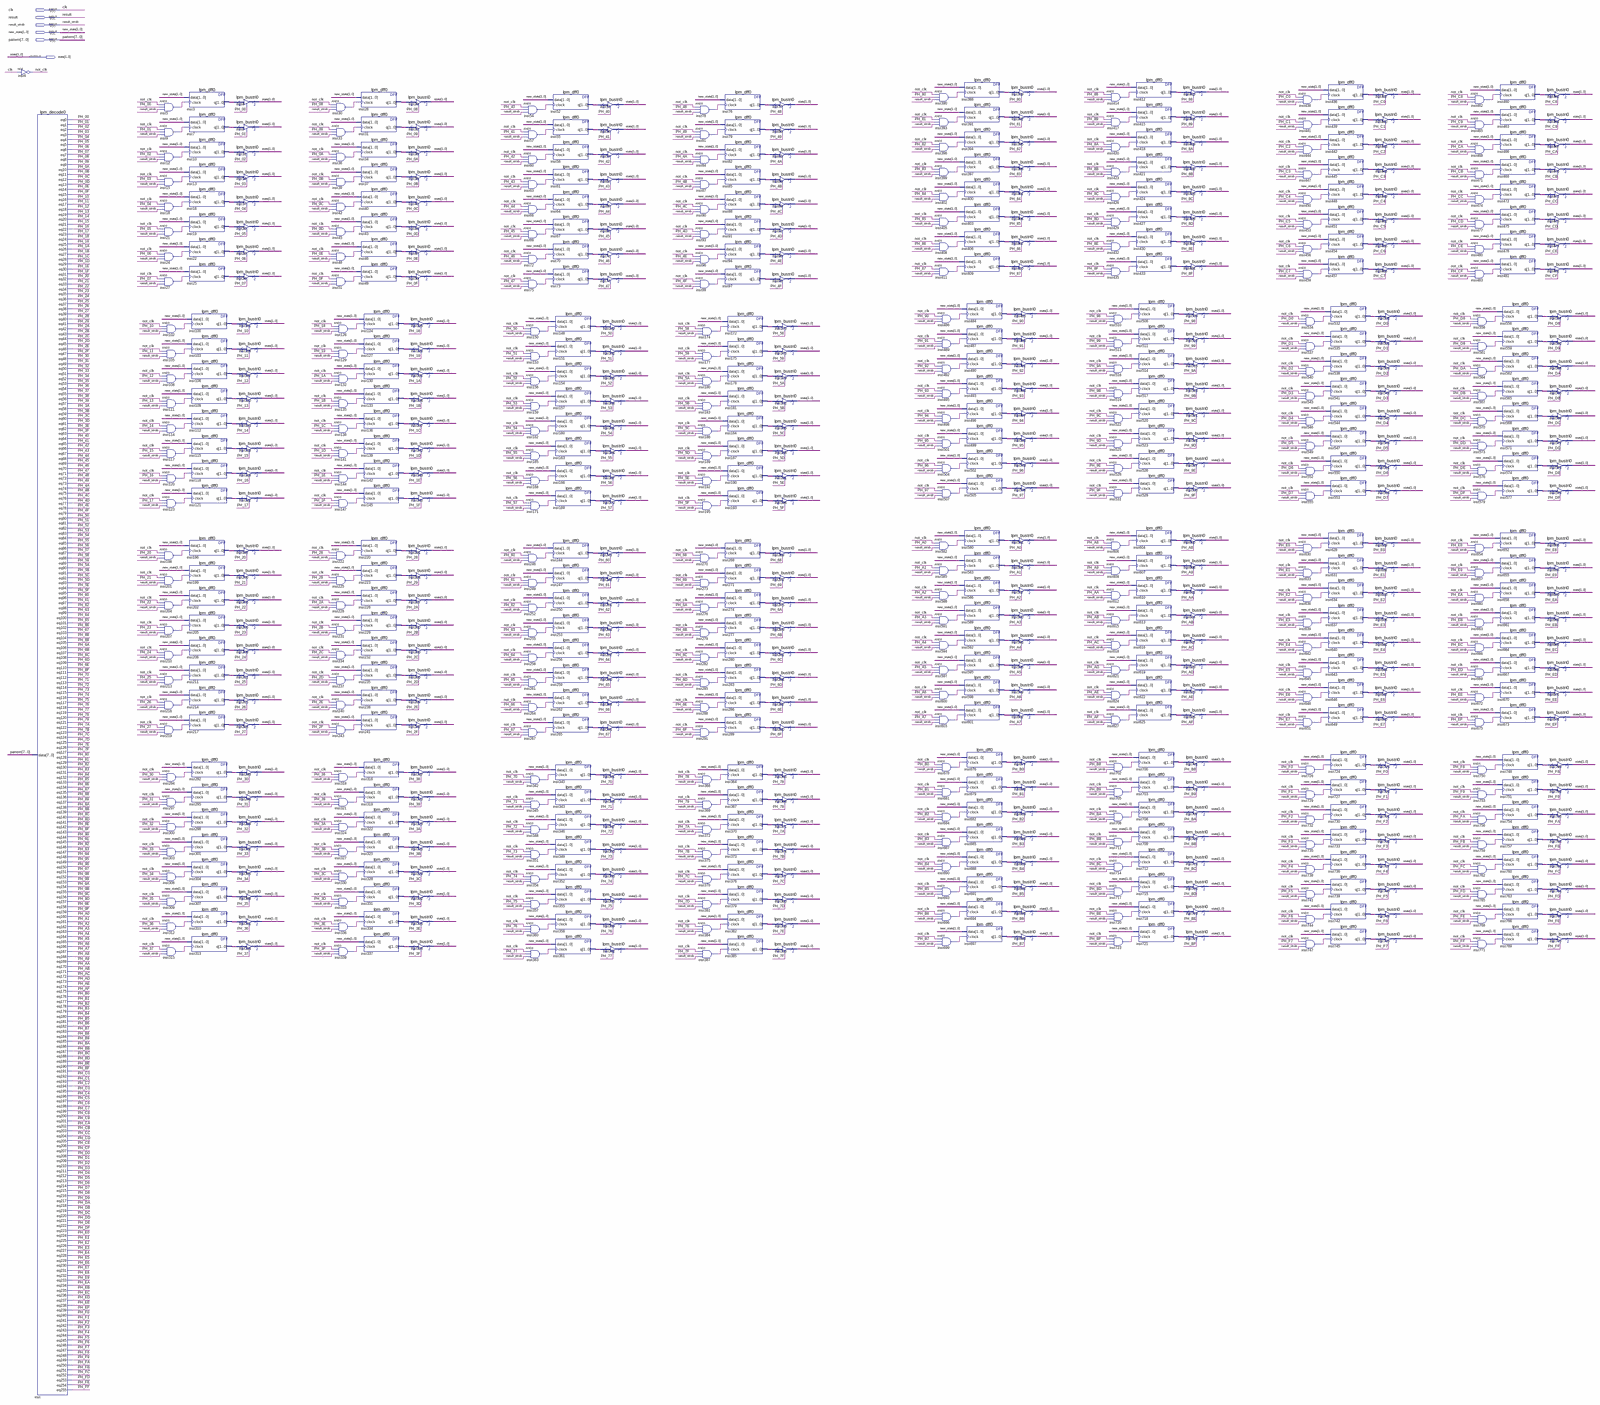
[diagram p0: schematic sheet, whole]
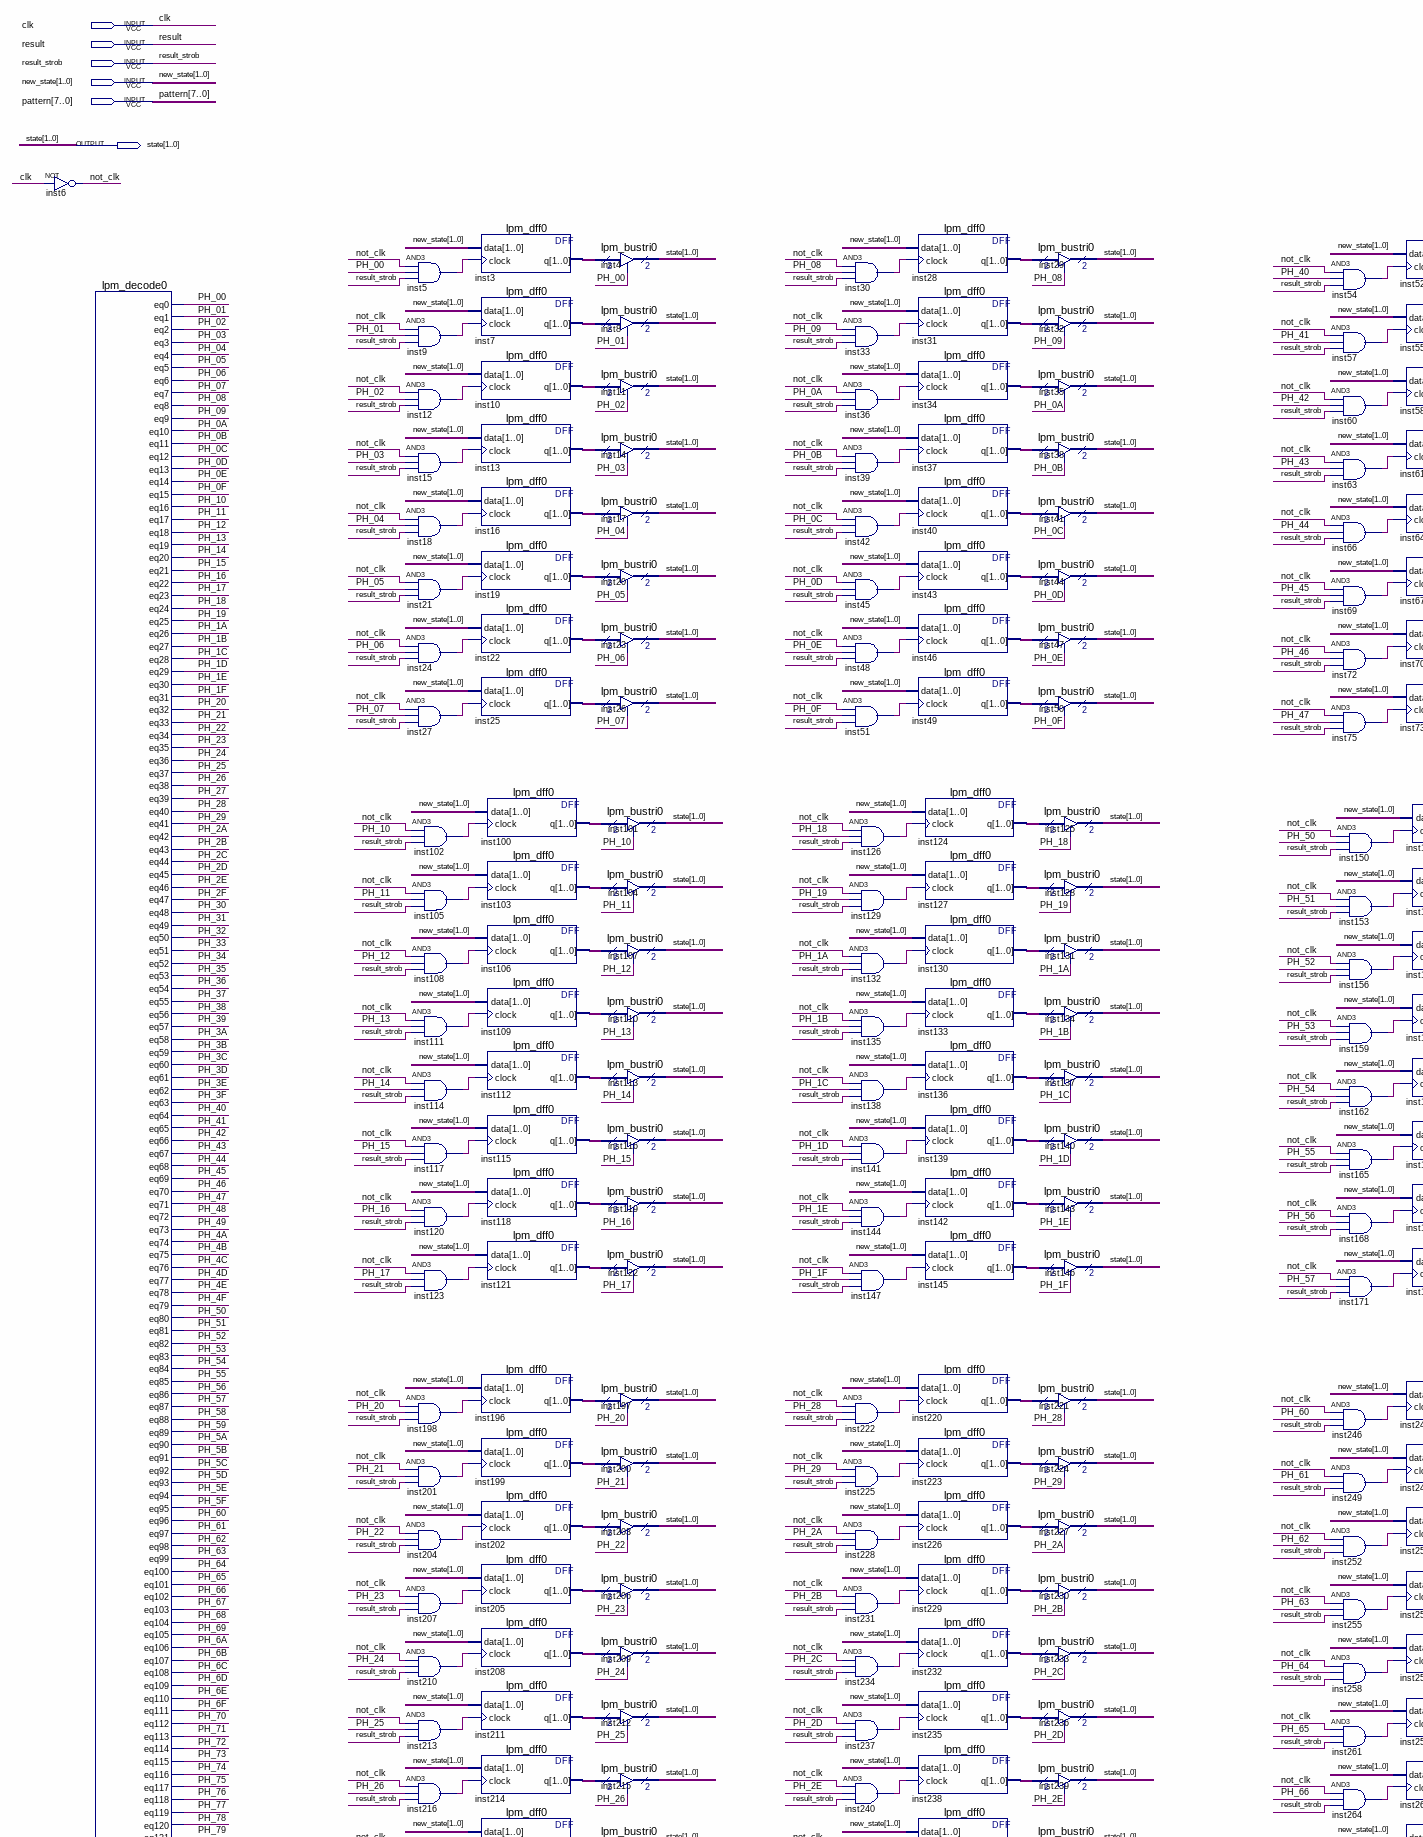
[diagram p1: schematic sheet, upper left part]
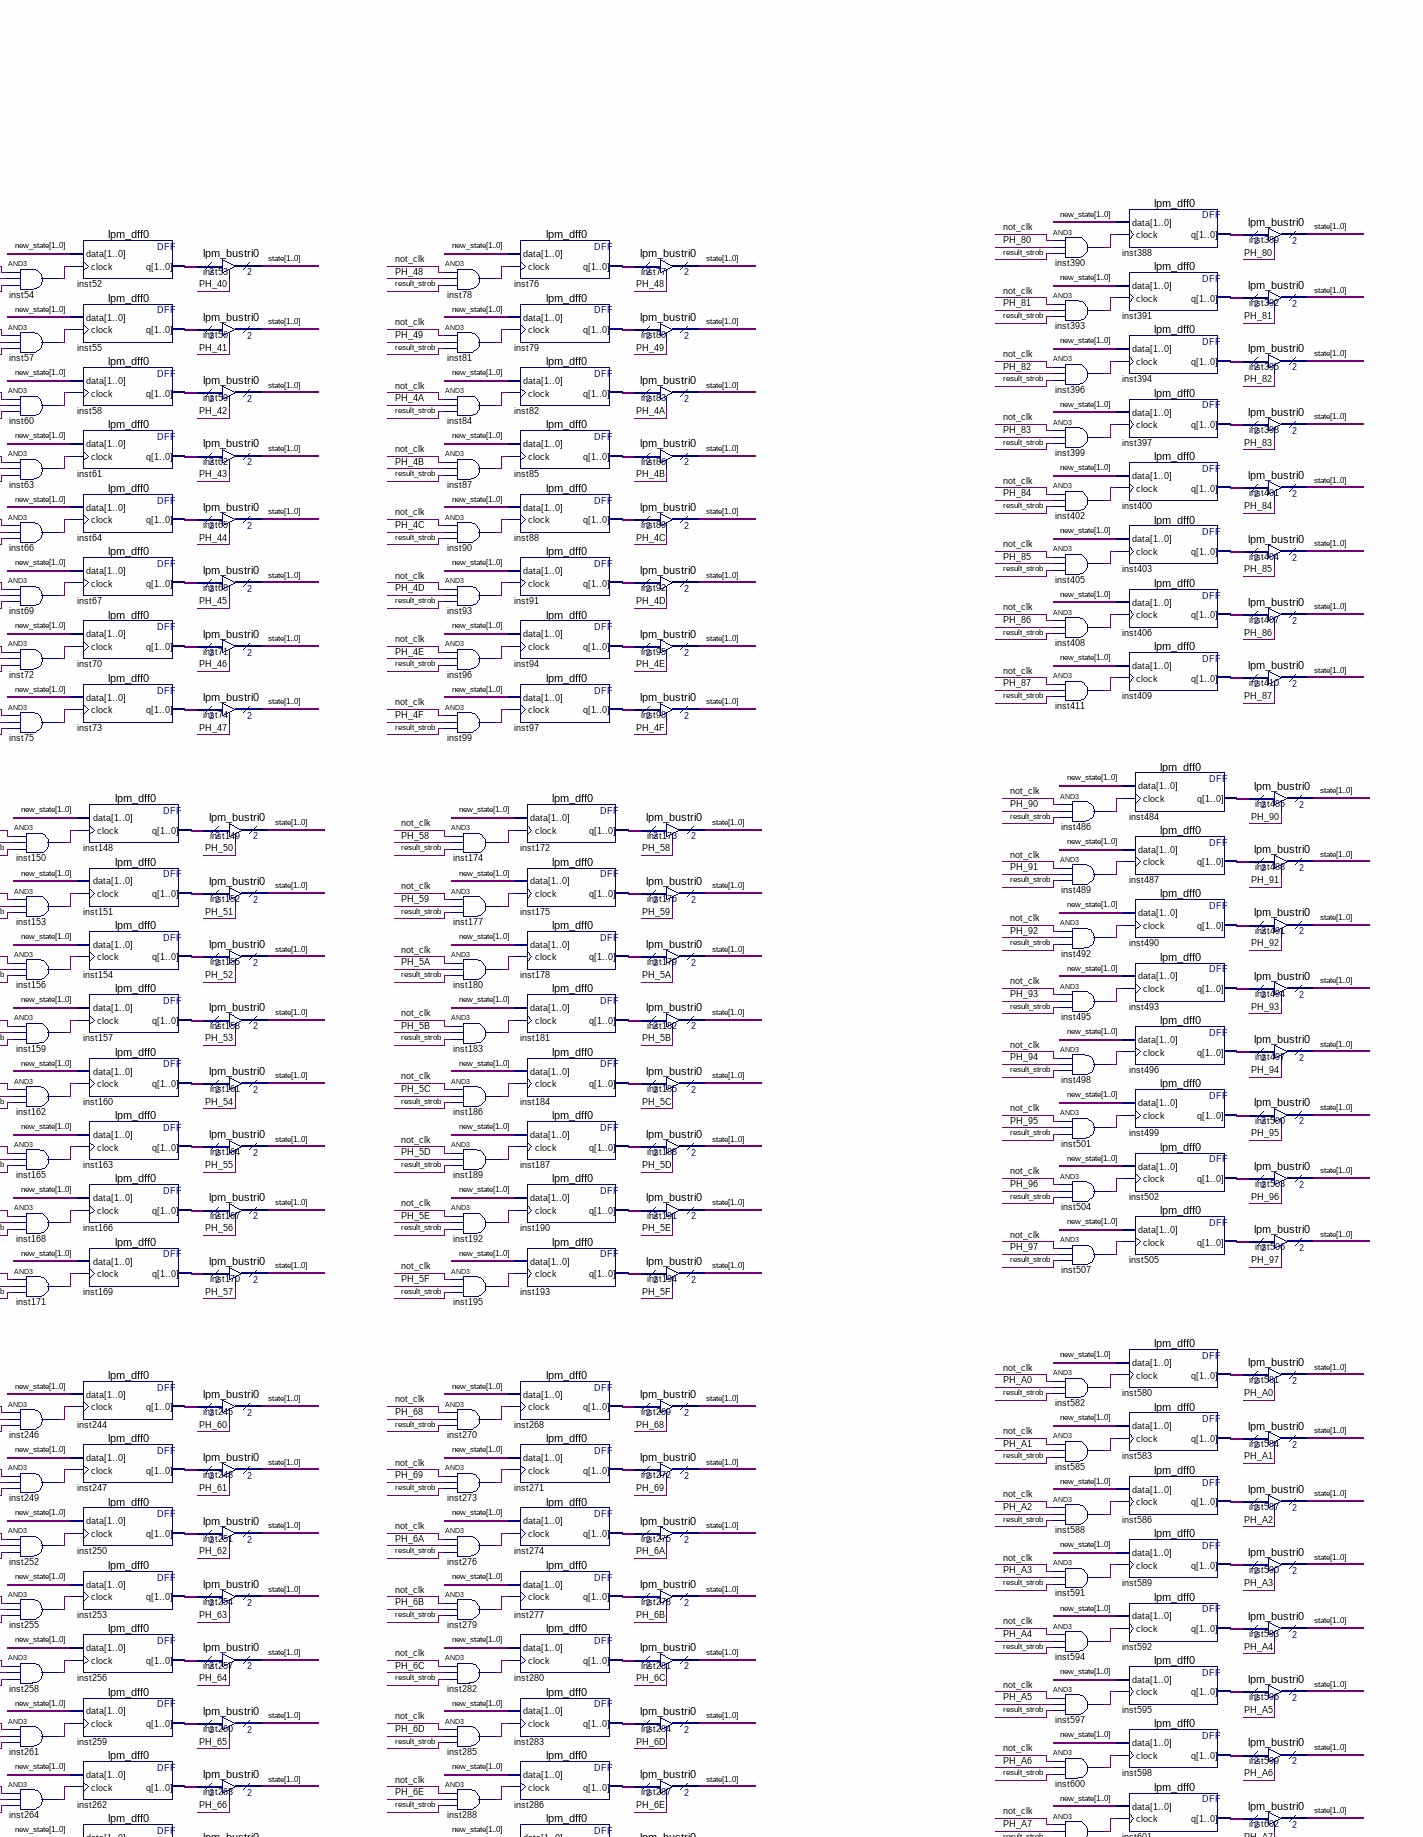
[diagram p2: schematic sheet, upper centre part]
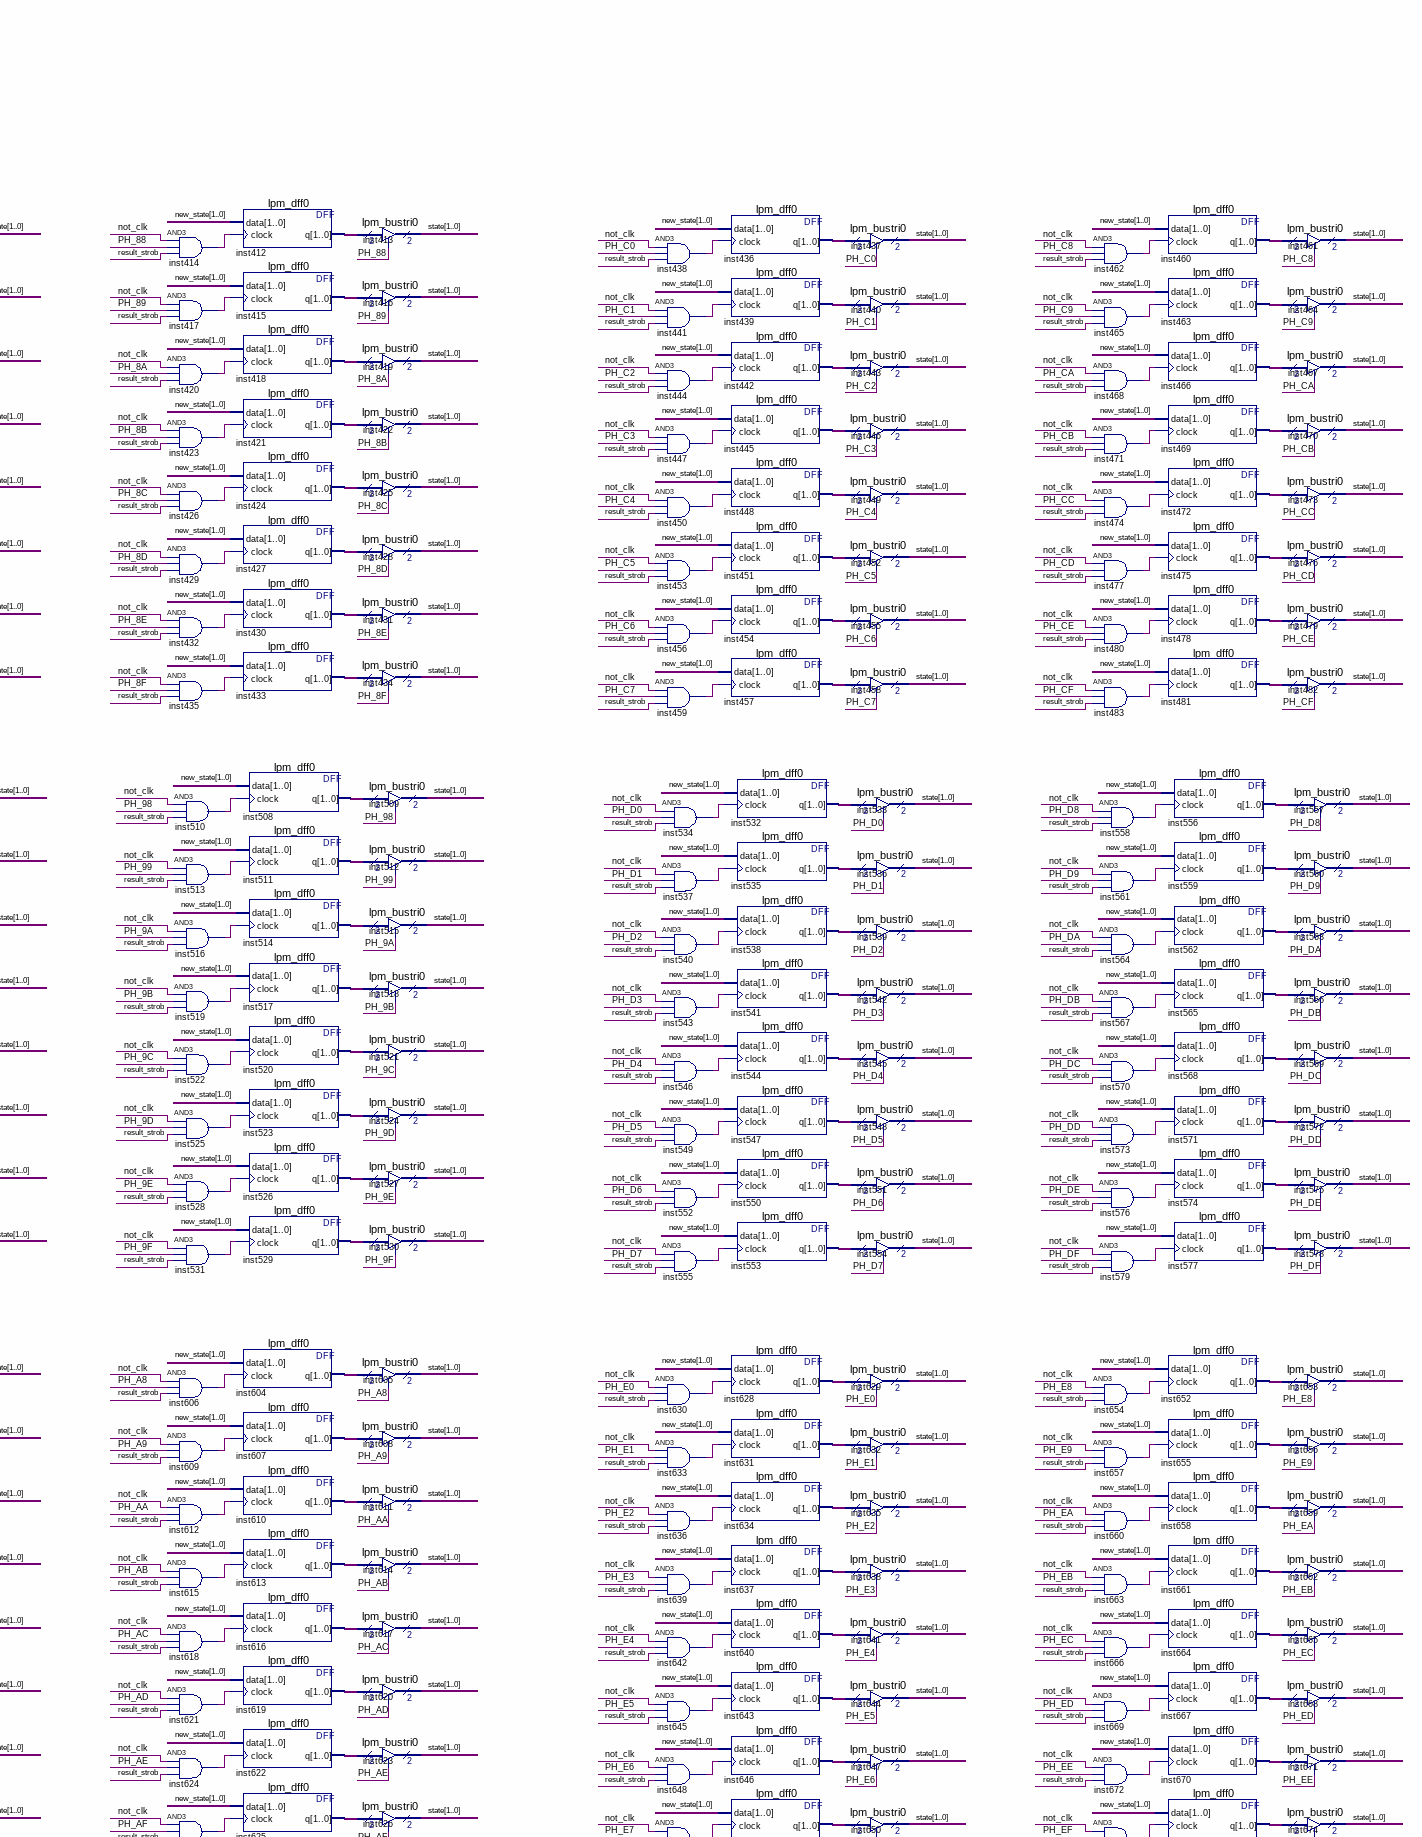
[diagram p3: schematic sheet, upper right part]
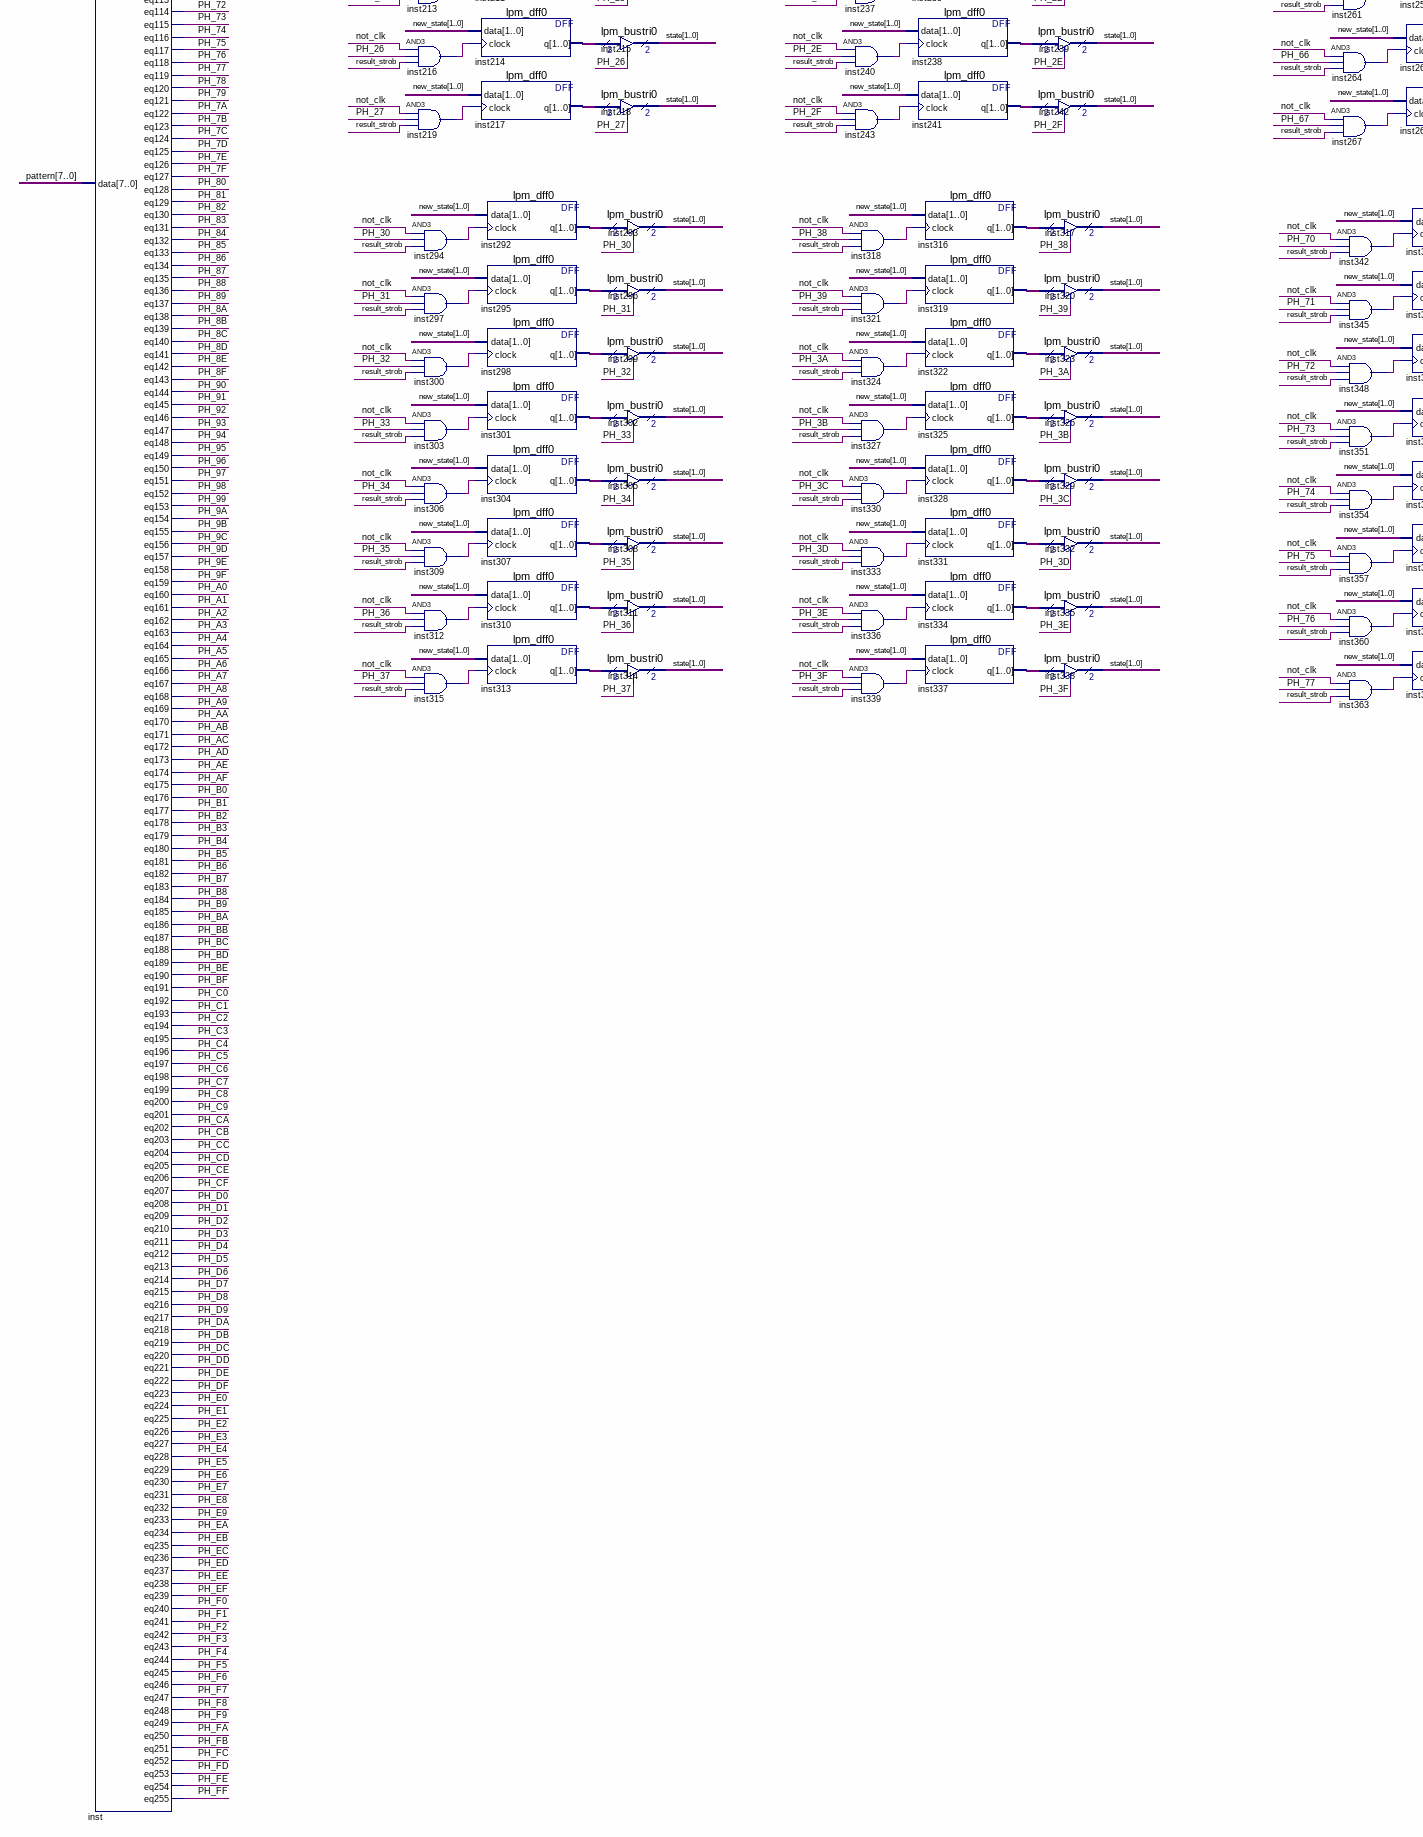
[diagram p4: schematic sheet, lower left part]
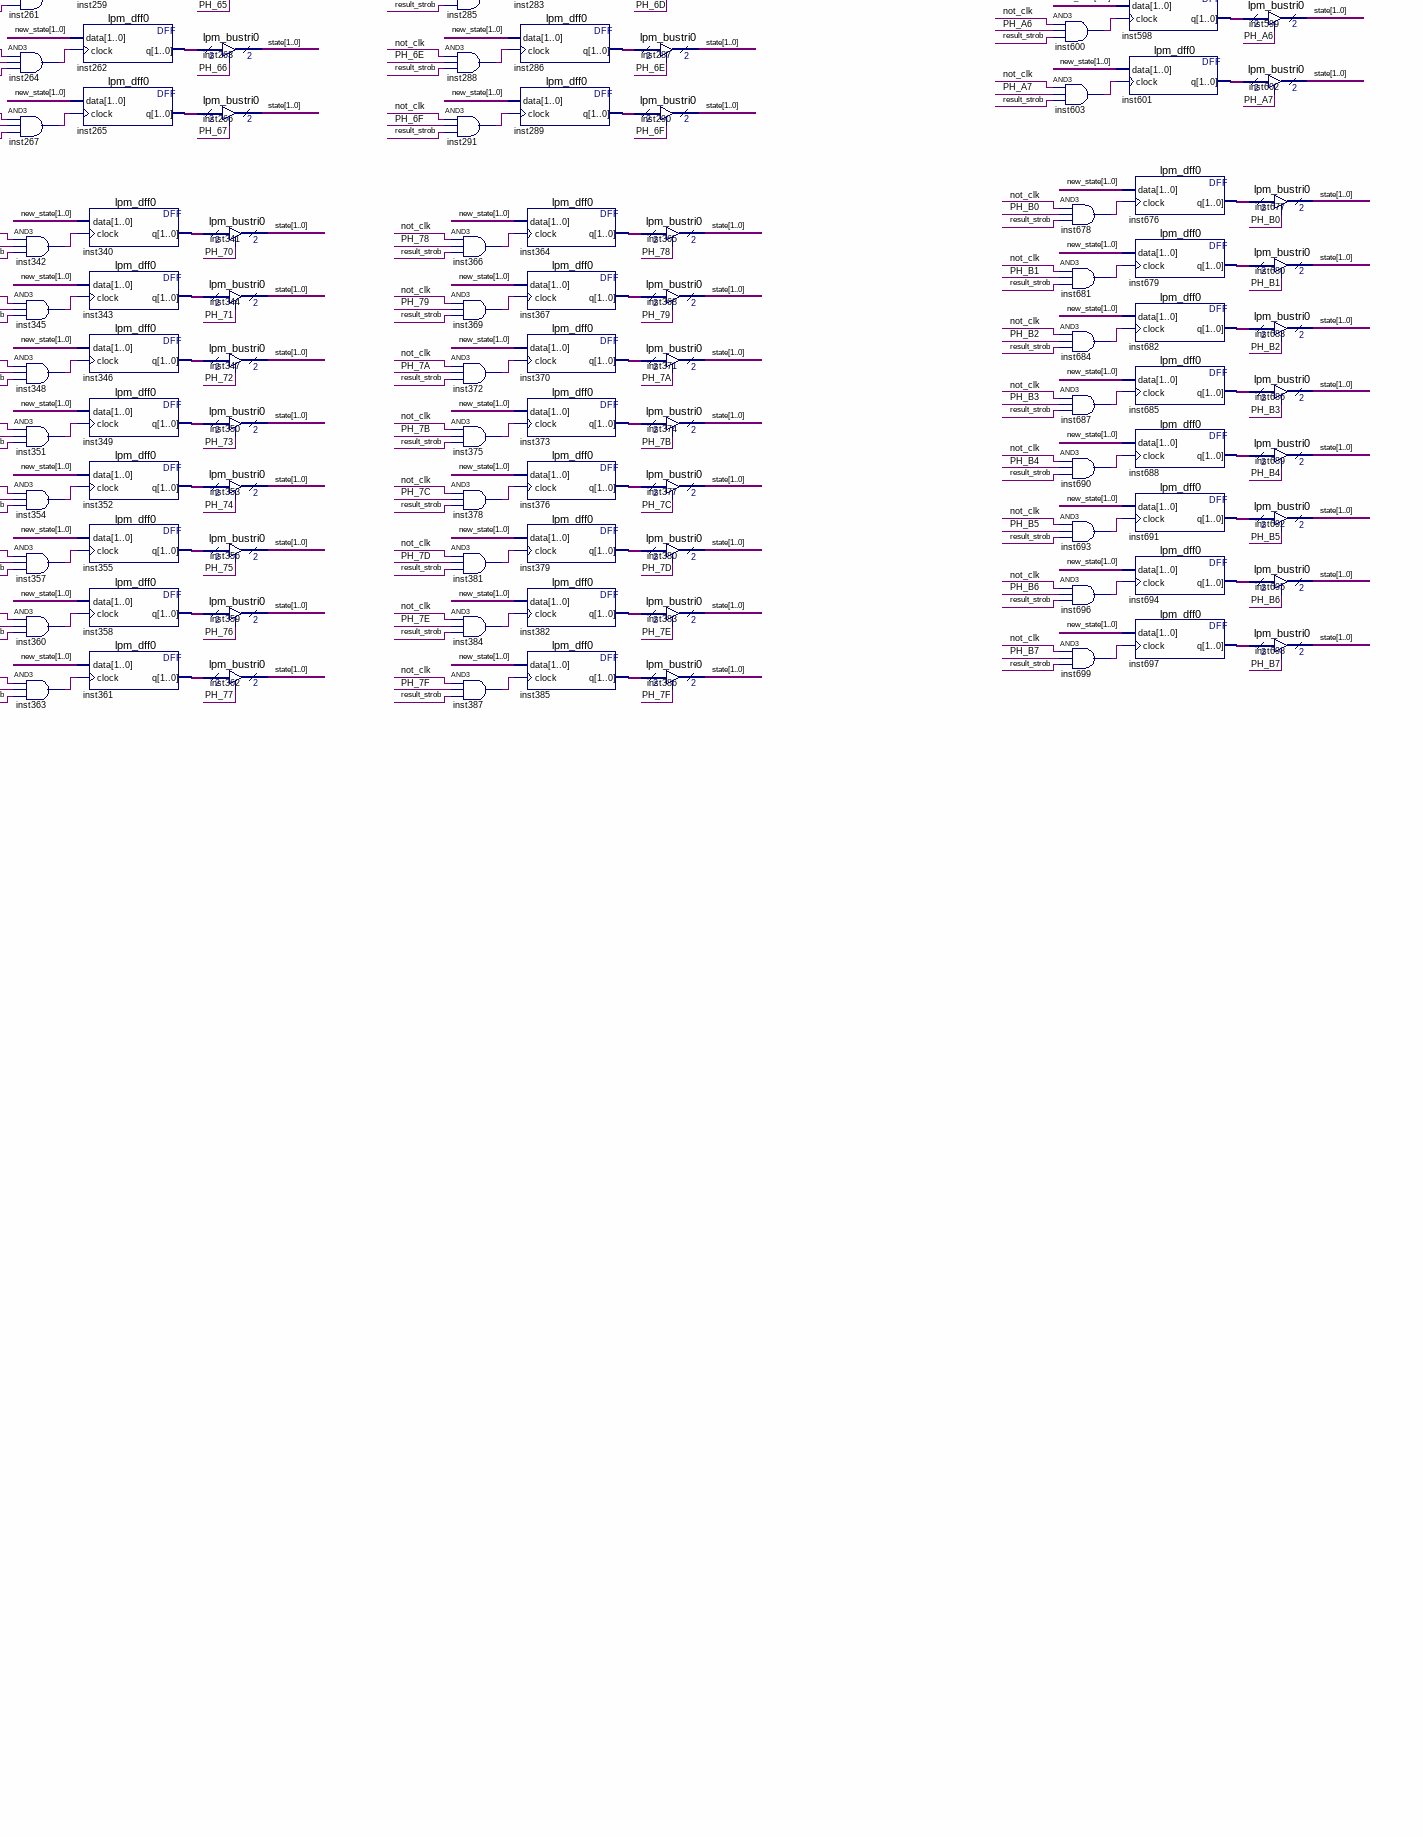
[diagram p5: schematic sheet, lower centre part]
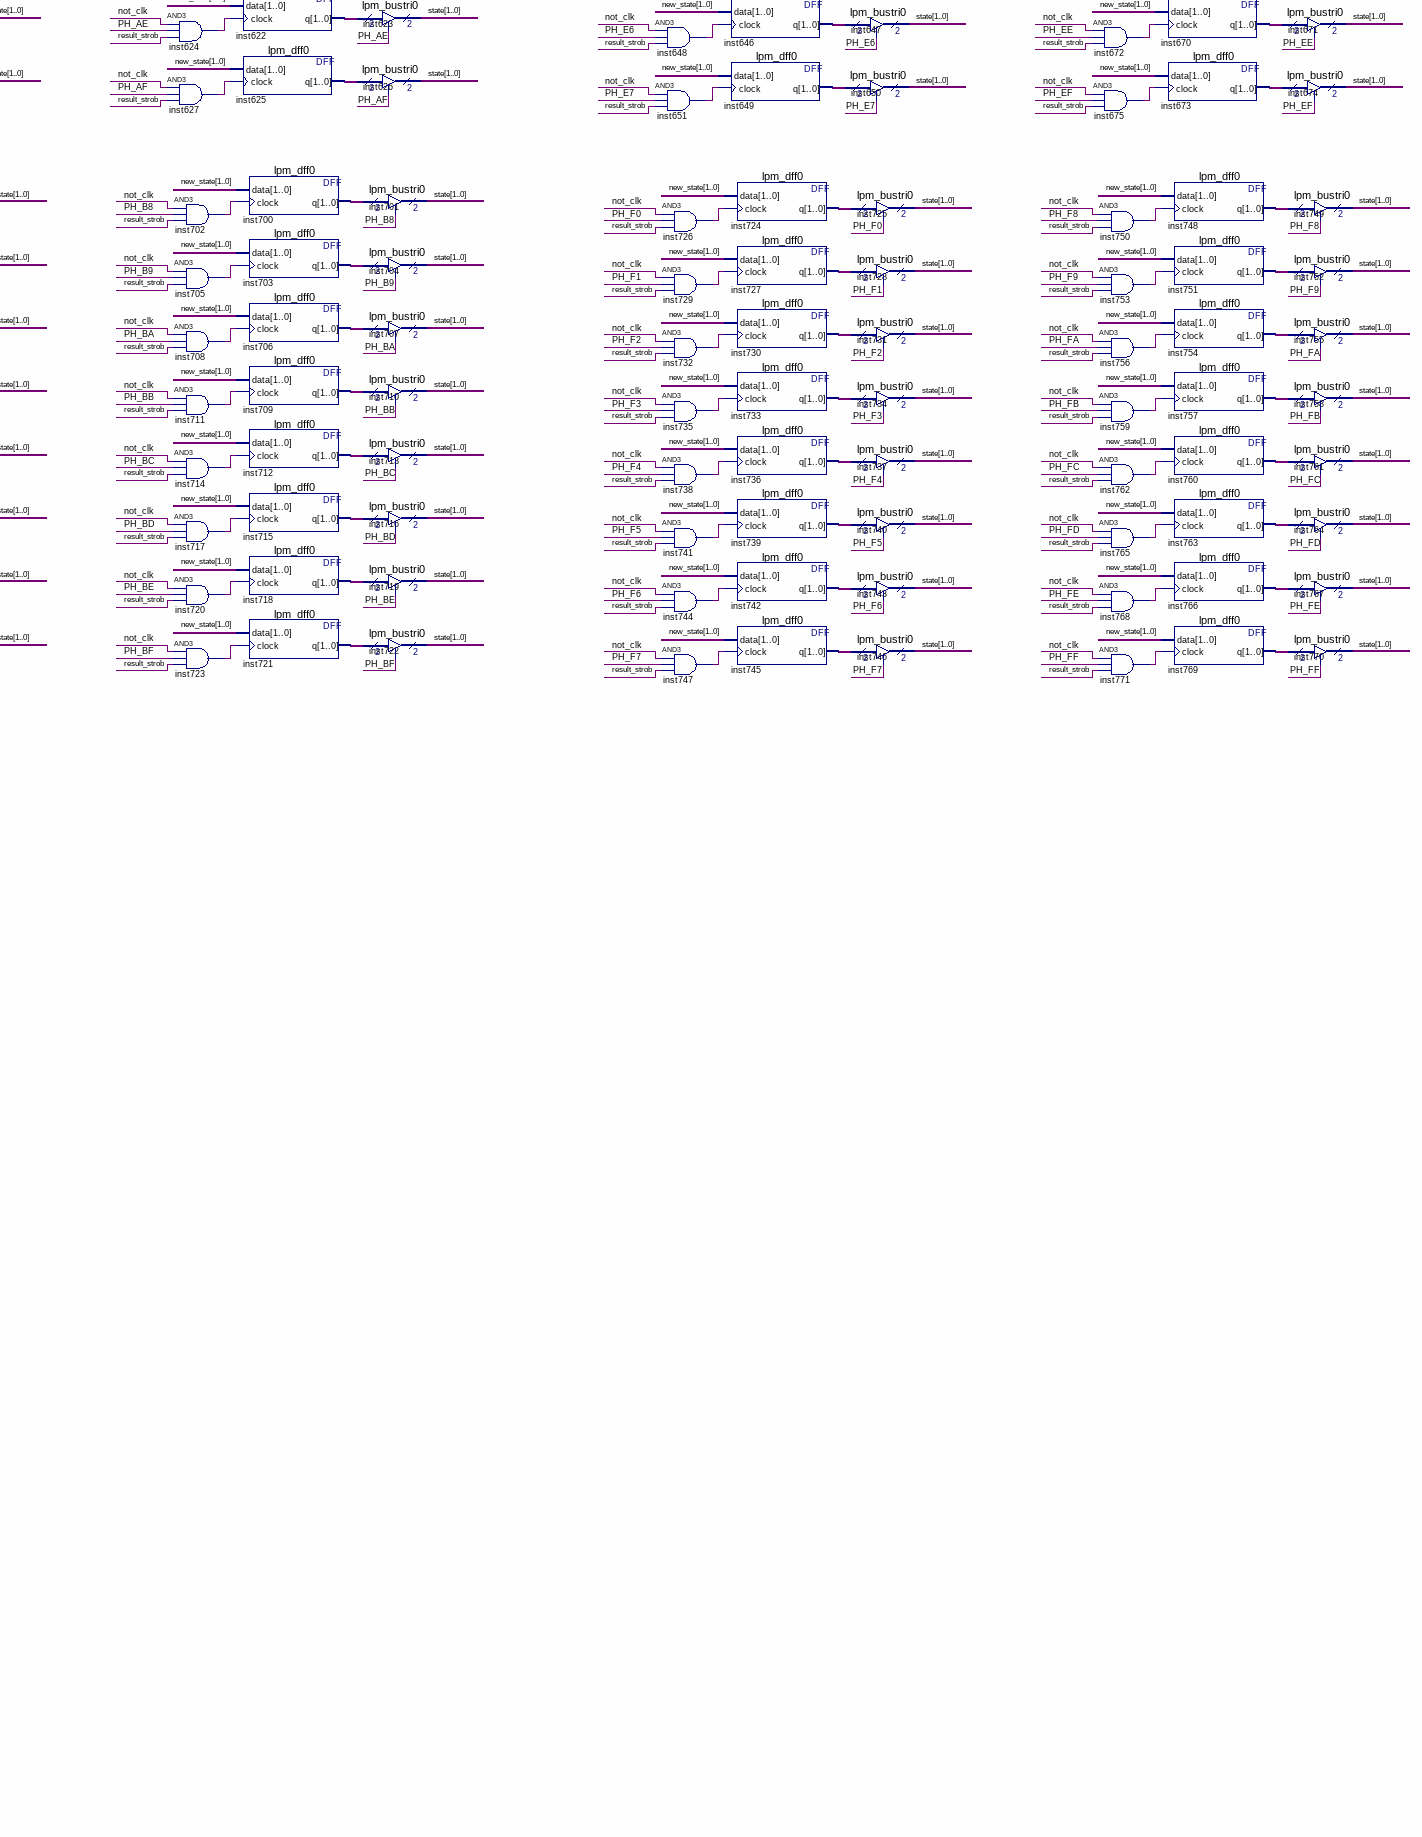
[diagram p6: schematic sheet, lower right part]
// Quartus schematic PHT.bdf as structural Verilog: 770 symbols, 6 pins
module PHT (
  input  clk,
  input  result,
  input  result_strob,
  input  [1:0] new_state,
  input  [7:0] pattern,
  output [1:0] state
);

  wire inst5_out, inst9_out, inst12_out, inst15_out, inst18_out, inst21_out, inst24_out, inst27_out,
       inst30_out, inst33_out, inst36_out, inst39_out, inst42_out, inst45_out, inst48_out, inst51_out,
       inst54_out, inst57_out, inst60_out, inst63_out, inst66_out, inst69_out, inst72_out, inst75_out,
       inst78_out, inst81_out, inst84_out, inst87_out, inst90_out, inst93_out, inst96_out, inst99_out,
       inst102_out, inst105_out, inst108_out, inst111_out, inst114_out, inst117_out, inst120_out,
       inst123_out, inst126_out, inst129_out, inst132_out, inst135_out, inst138_out, inst141_out,
       inst144_out, inst147_out, inst150_out, inst153_out, inst156_out, inst159_out, inst162_out,
       inst165_out, inst168_out, inst171_out, inst174_out, inst177_out, inst180_out, inst183_out,
       inst186_out, inst189_out, inst192_out, inst195_out, inst198_out, inst201_out, inst204_out,
       inst207_out, inst210_out, inst213_out, inst216_out, inst219_out, inst222_out, inst225_out,
       inst228_out, inst231_out, inst234_out, inst237_out, inst240_out, inst243_out, inst246_out,
       inst249_out, inst252_out, inst255_out, inst258_out, inst261_out, inst264_out, inst267_out,
       inst270_out, inst273_out, inst276_out, inst279_out, inst282_out, inst285_out, inst288_out,
       inst291_out, inst294_out, inst297_out, inst300_out, inst303_out, inst306_out, inst309_out,
       inst312_out, inst315_out, inst318_out, inst321_out, inst324_out, inst327_out, inst330_out,
       inst333_out, inst336_out, inst339_out, inst342_out, inst345_out, inst348_out, inst351_out,
       inst354_out, inst357_out, inst360_out, inst363_out, inst366_out, inst369_out, inst372_out,
       inst375_out, inst378_out, inst381_out, inst384_out, inst387_out, inst390_out, inst393_out,
       inst396_out, inst399_out, inst402_out, inst405_out, inst408_out, inst411_out, inst414_out,
       inst417_out, inst420_out, inst423_out, inst426_out, inst429_out, inst432_out, inst435_out,
       inst438_out, inst441_out, inst444_out, inst447_out, inst450_out, inst453_out, inst456_out,
       inst459_out, inst462_out, inst465_out, inst468_out, inst471_out, inst474_out, inst477_out,
       inst480_out, inst483_out, inst486_out, inst489_out, inst492_out, inst495_out, inst498_out,
       inst501_out, inst504_out, inst507_out, inst510_out, inst513_out, inst516_out, inst519_out,
       inst522_out, inst525_out, inst528_out, inst531_out, inst534_out, inst537_out, inst540_out,
       inst543_out, inst546_out, inst549_out, inst552_out, inst555_out, inst558_out, inst561_out,
       inst564_out, inst567_out, inst570_out, inst573_out, inst576_out, inst579_out, inst582_out,
       inst585_out, inst588_out, inst591_out, inst594_out, inst597_out, inst600_out, inst603_out,
       inst606_out, inst609_out, inst612_out, inst615_out, inst618_out, inst621_out, inst624_out,
       inst627_out, inst630_out, inst633_out, inst636_out, inst639_out, inst642_out, inst645_out,
       inst648_out, inst651_out, inst654_out, inst657_out, inst660_out, inst663_out, inst666_out,
       inst669_out, inst672_out, inst675_out, inst678_out, inst681_out, inst684_out, inst687_out,
       inst690_out, inst693_out, inst696_out, inst699_out, inst702_out, inst705_out, inst708_out,
       inst711_out, inst714_out, inst717_out, inst720_out, inst723_out, inst726_out, inst729_out,
       inst732_out, inst735_out, inst738_out, inst741_out, inst744_out, inst747_out, inst750_out,
       inst753_out, inst756_out, inst759_out, inst762_out, inst765_out, inst768_out, inst771_out, not_clk,
       PH_00, PH_0A, PH_0B, PH_0C, PH_0D, PH_0E, PH_0F, PH_01, PH_1A, PH_1B, PH_1C, PH_1D, PH_1E, PH_1F,
       PH_02, PH_2A, PH_2B, PH_2C, PH_2D, PH_2E, PH_2F, PH_03, PH_3A, PH_3B, PH_3C, PH_3D, PH_3E, PH_3F,
       PH_04, PH_4A, PH_4B, PH_4C, PH_4D, PH_4E, PH_4F, PH_05, PH_5A, PH_5B, PH_5C, PH_5D, PH_5E, PH_5F,
       PH_06, PH_6A, PH_6B, PH_6C, PH_6D, PH_6E, PH_6F, PH_07, PH_7A, PH_7B, PH_7C, PH_7D, PH_7E, PH_7F,
       PH_08, PH_8A, PH_8B, PH_8C, PH_8D, PH_8E, PH_8F, PH_09, PH_9A, PH_9B, PH_9C, PH_9D, PH_9E, PH_9F,
       PH_10, PH_11, PH_12, PH_13, PH_14, PH_15, PH_16, PH_17, PH_18, PH_19, PH_20, PH_21, PH_22, PH_23,
       PH_24, PH_25, PH_26, PH_27, PH_28, PH_29, PH_30, PH_31, PH_32, PH_33, PH_34, PH_35, PH_36, PH_37,
       PH_38, PH_39, PH_40, PH_41, PH_42, PH_43, PH_44, PH_45, PH_46, PH_47, PH_48, PH_49, PH_50, PH_51,
       PH_52, PH_53, PH_54, PH_55, PH_56, PH_57, PH_58, PH_59, PH_60, PH_61, PH_62, PH_63, PH_64, PH_65,
       PH_66, PH_67, PH_68, PH_69, PH_70, PH_71, PH_72, PH_73, PH_74, PH_75, PH_76, PH_77, PH_78, PH_79,
       PH_80, PH_81, PH_82, PH_83, PH_84, PH_85, PH_86, PH_87, PH_88, PH_89, PH_90, PH_91, PH_92, PH_93,
       PH_94, PH_95, PH_96, PH_97, PH_98, PH_99, PH_A0, PH_A1, PH_A2, PH_A3, PH_A4, PH_A5, PH_A6, PH_A7,
       PH_A8, PH_A9, PH_AA, PH_AB, PH_AC, PH_AD, PH_AE, PH_AF, PH_B0, PH_B1, PH_B2, PH_B3, PH_B4, PH_B5,
       PH_B6, PH_B7, PH_B8, PH_B9, PH_BA, PH_BB, PH_BC, PH_BD, PH_BE, PH_BF, PH_C0, PH_C1, PH_C2, PH_C3,
       PH_C4, PH_C5, PH_C6, PH_C7, PH_C8, PH_C9, PH_CA, PH_CB, PH_CC, PH_CD, PH_CE, PH_CF, PH_D0, PH_D1,
       PH_D2, PH_D3, PH_D4, PH_D5, PH_D6, PH_D7, PH_D8, PH_D9, PH_DA, PH_DB, PH_DC, PH_DD, PH_DE, PH_DF,
       PH_E0, PH_E1, PH_E2, PH_E3, PH_E4, PH_E5, PH_E6, PH_E7, PH_E8, PH_E9, PH_EA, PH_EB, PH_EC, PH_ED,
       PH_EE, PH_EF, PH_F0, PH_F1, PH_F2, PH_F3, PH_F4, PH_F5, PH_F6, PH_F7, PH_F8, PH_F9, PH_FA, PH_FB,
       PH_FC, PH_FD, PH_FE, PH_FF;
  wire [1:0] inst3_q, inst7_q, inst10_q, inst13_q, inst16_q, inst19_q, inst22_q, inst25_q, inst28_q,
       inst31_q, inst34_q, inst37_q, inst40_q, inst43_q, inst46_q, inst49_q, inst52_q, inst55_q, inst58_q,
       inst61_q, inst64_q, inst67_q, inst70_q, inst73_q, inst76_q, inst79_q, inst82_q, inst85_q, inst88_q,
       inst91_q, inst94_q, inst97_q, inst100_q, inst103_q, inst106_q, inst109_q, inst112_q, inst115_q,
       inst118_q, inst121_q, inst124_q, inst127_q, inst130_q, inst133_q, inst136_q, inst139_q, inst142_q,
       inst145_q, inst148_q, inst151_q, inst154_q, inst157_q, inst160_q, inst163_q, inst166_q, inst169_q,
       inst172_q, inst175_q, inst178_q, inst181_q, inst184_q, inst187_q, inst190_q, inst193_q, inst196_q,
       inst199_q, inst202_q, inst205_q, inst208_q, inst211_q, inst214_q, inst217_q, inst220_q, inst223_q,
       inst226_q, inst229_q, inst232_q, inst235_q, inst238_q, inst241_q, inst244_q, inst247_q, inst250_q,
       inst253_q, inst256_q, inst259_q, inst262_q, inst265_q, inst268_q, inst271_q, inst274_q, inst277_q,
       inst280_q, inst283_q, inst286_q, inst289_q, inst292_q, inst295_q, inst298_q, inst301_q, inst304_q,
       inst307_q, inst310_q, inst313_q, inst316_q, inst319_q, inst322_q, inst325_q, inst328_q, inst331_q,
       inst334_q, inst337_q, inst340_q, inst343_q, inst346_q, inst349_q, inst352_q, inst355_q, inst358_q,
       inst361_q, inst364_q, inst367_q, inst370_q, inst373_q, inst376_q, inst379_q, inst382_q, inst385_q,
       inst388_q, inst391_q, inst394_q, inst397_q, inst400_q, inst403_q, inst406_q, inst409_q, inst412_q,
       inst415_q, inst418_q, inst421_q, inst424_q, inst427_q, inst430_q, inst433_q, inst436_q, inst439_q,
       inst442_q, inst445_q, inst448_q, inst451_q, inst454_q, inst457_q, inst460_q, inst463_q, inst466_q,
       inst469_q, inst472_q, inst475_q, inst478_q, inst481_q, inst484_q, inst487_q, inst490_q, inst493_q,
       inst496_q, inst499_q, inst502_q, inst505_q, inst508_q, inst511_q, inst514_q, inst517_q, inst520_q,
       inst523_q, inst526_q, inst529_q, inst532_q, inst535_q, inst538_q, inst541_q, inst544_q, inst547_q,
       inst550_q, inst553_q, inst556_q, inst559_q, inst562_q, inst565_q, inst568_q, inst571_q, inst574_q,
       inst577_q, inst580_q, inst583_q, inst586_q, inst589_q, inst592_q, inst595_q, inst598_q, inst601_q,
       inst604_q, inst607_q, inst610_q, inst613_q, inst616_q, inst619_q, inst622_q, inst625_q, inst628_q,
       inst631_q, inst634_q, inst637_q, inst640_q, inst643_q, inst646_q, inst649_q, inst652_q, inst655_q,
       inst658_q, inst661_q, inst664_q, inst667_q, inst670_q, inst673_q, inst676_q, inst679_q, inst682_q,
       inst685_q, inst688_q, inst691_q, inst694_q, inst697_q, inst700_q, inst703_q, inst706_q, inst709_q,
       inst712_q, inst715_q, inst718_q, inst721_q, inst724_q, inst727_q, inst730_q, inst733_q, inst736_q,
       inst739_q, inst742_q, inst745_q, inst748_q, inst751_q, inst754_q, inst757_q, inst760_q, inst763_q,
       inst766_q, inst769_q;

  not inst6 (not_clk, clk);
  lpm_decode0 inst (
    .data(pattern), .eq0(PH_00), .eq1(PH_01), .eq2(PH_02), .eq3(PH_03), .eq4(PH_04), .eq5(PH_05),
    .eq6(PH_06), .eq7(PH_07), .eq8(PH_08), .eq9(PH_09), .eq10(PH_0A), .eq11(PH_0B), .eq12(PH_0C),
    .eq13(PH_0D), .eq14(PH_0E), .eq15(PH_0F), .eq16(PH_10), .eq17(PH_11), .eq18(PH_12), .eq19(PH_13),
    .eq20(PH_14), .eq21(PH_15), .eq22(PH_16), .eq23(PH_17), .eq24(PH_18), .eq25(PH_19), .eq26(PH_1A),
    .eq27(PH_1B), .eq28(PH_1C), .eq29(PH_1D), .eq30(PH_1E), .eq31(PH_1F), .eq32(PH_20), .eq33(PH_21),
    .eq34(PH_22), .eq35(PH_23), .eq36(PH_24), .eq37(PH_25), .eq38(PH_26), .eq39(PH_27), .eq40(PH_28),
    .eq41(PH_29), .eq42(PH_2A), .eq43(PH_2B), .eq44(PH_2C), .eq45(PH_2D), .eq46(PH_2E), .eq47(PH_2F),
    .eq48(PH_30), .eq49(PH_31), .eq50(PH_32), .eq51(PH_33), .eq52(PH_34), .eq53(PH_35), .eq54(PH_36),
    .eq55(PH_37), .eq56(PH_38), .eq57(PH_39), .eq58(PH_3A), .eq59(PH_3B), .eq60(PH_3C), .eq61(PH_3D),
    .eq62(PH_3E), .eq63(PH_3F), .eq64(PH_40), .eq65(PH_41), .eq66(PH_42), .eq67(PH_43), .eq68(PH_44),
    .eq69(PH_45), .eq70(PH_46), .eq71(PH_47), .eq72(PH_48), .eq73(PH_49), .eq74(PH_4A), .eq75(PH_4B),
    .eq76(PH_4C), .eq77(PH_4D), .eq78(PH_4E), .eq79(PH_4F), .eq80(PH_50), .eq81(PH_51), .eq82(PH_52),
    .eq83(PH_53), .eq84(PH_54), .eq85(PH_55), .eq86(PH_56), .eq87(PH_57), .eq88(PH_58), .eq89(PH_59),
    .eq90(PH_5A), .eq91(PH_5B), .eq92(PH_5C), .eq93(PH_5D), .eq94(PH_5E), .eq95(PH_5F), .eq96(PH_60),
    .eq97(PH_61), .eq98(PH_62), .eq99(PH_63), .eq100(PH_64), .eq101(PH_65), .eq102(PH_66), .eq103(PH_67),
    .eq104(PH_68), .eq105(PH_69), .eq106(PH_6A), .eq107(PH_6B), .eq108(PH_6C), .eq109(PH_6D), .eq110(PH_6E),
    .eq111(PH_6F), .eq112(PH_70), .eq113(PH_71), .eq114(PH_72), .eq115(PH_73), .eq116(PH_74), .eq117(PH_75),
    .eq118(PH_76), .eq119(PH_77), .eq120(PH_78), .eq121(PH_79), .eq122(PH_7A), .eq123(PH_7B), .eq124(PH_7C),
    .eq125(PH_7D), .eq126(PH_7E), .eq127(PH_7F), .eq128(PH_80), .eq129(PH_81), .eq130(PH_82), .eq131(PH_83),
    .eq132(PH_84), .eq133(PH_85), .eq134(PH_86), .eq135(PH_87), .eq136(PH_88), .eq137(PH_89), .eq138(PH_8A),
    .eq139(PH_8B), .eq140(PH_8C), .eq141(PH_8D), .eq142(PH_8E), .eq143(PH_8F), .eq144(PH_90), .eq145(PH_91),
    .eq146(PH_92), .eq147(PH_93), .eq148(PH_94), .eq149(PH_95), .eq150(PH_96), .eq151(PH_97), .eq152(PH_98),
    .eq153(PH_99), .eq154(PH_9A), .eq155(PH_9B), .eq156(PH_9C), .eq157(PH_9D), .eq158(PH_9E), .eq159(PH_9F),
    .eq160(PH_A0), .eq161(PH_A1), .eq162(PH_A2), .eq163(PH_A3), .eq164(PH_A4), .eq165(PH_A5), .eq166(PH_A6),
    .eq167(PH_A7), .eq168(PH_A8), .eq169(PH_A9), .eq170(PH_AA), .eq171(PH_AB), .eq172(PH_AC), .eq173(PH_AD),
    .eq174(PH_AE), .eq175(PH_AF), .eq176(PH_B0), .eq177(PH_B1), .eq178(PH_B2), .eq179(PH_B3), .eq180(PH_B4),
    .eq181(PH_B5), .eq182(PH_B6), .eq183(PH_B7), .eq184(PH_B8), .eq185(PH_B9), .eq186(PH_BA), .eq187(PH_BB),
    .eq188(PH_BC), .eq189(PH_BD), .eq190(PH_BE), .eq191(PH_BF), .eq192(PH_C0), .eq193(PH_C1), .eq194(PH_C2),
    .eq195(PH_C3), .eq196(PH_C4), .eq197(PH_C5), .eq198(PH_C6), .eq199(PH_C7), .eq200(PH_C8), .eq201(PH_C9),
    .eq202(PH_CA), .eq203(PH_CB), .eq204(PH_CC), .eq205(PH_CD), .eq206(PH_CE), .eq207(PH_CF), .eq208(PH_D0),
    .eq209(PH_D1), .eq210(PH_D2), .eq211(PH_D3), .eq212(PH_D4), .eq213(PH_D5), .eq214(PH_D6), .eq215(PH_D7),
    .eq216(PH_D8), .eq217(PH_D9), .eq218(PH_DA), .eq219(PH_DB), .eq220(PH_DC), .eq221(PH_DD), .eq222(PH_DE),
    .eq223(PH_DF), .eq224(PH_E0), .eq225(PH_E1), .eq226(PH_E2), .eq227(PH_E3), .eq228(PH_E4), .eq229(PH_E5),
    .eq230(PH_E6), .eq231(PH_E7), .eq232(PH_E8), .eq233(PH_E9), .eq234(PH_EA), .eq235(PH_EB), .eq236(PH_EC),
    .eq237(PH_ED), .eq238(PH_EE), .eq239(PH_EF), .eq240(PH_F0), .eq241(PH_F1), .eq242(PH_F2), .eq243(PH_F3),
    .eq244(PH_F4), .eq245(PH_F5), .eq246(PH_F6), .eq247(PH_F7), .eq248(PH_F8), .eq249(PH_F9), .eq250(PH_FA),
    .eq251(PH_FB), .eq252(PH_FC), .eq253(PH_FD), .eq254(PH_FE), .eq255(PH_FF));
  and inst5 (inst5_out, not_clk, PH_00, result_strob);
  and inst9 (inst9_out, not_clk, PH_01, result_strob);
  and inst12 (inst12_out, not_clk, PH_02, result_strob);
  and inst15 (inst15_out, not_clk, PH_03, result_strob);
  and inst18 (inst18_out, not_clk, PH_04, result_strob);
  and inst21 (inst21_out, not_clk, PH_05, result_strob);
  and inst24 (inst24_out, not_clk, PH_06, result_strob);
  and inst27 (inst27_out, not_clk, PH_07, result_strob);
  and inst102 (inst102_out, not_clk, PH_10, result_strob);
  and inst105 (inst105_out, not_clk, PH_11, result_strob);
  and inst108 (inst108_out, not_clk, PH_12, result_strob);
  and inst111 (inst111_out, not_clk, PH_13, result_strob);
  and inst114 (inst114_out, not_clk, PH_14, result_strob);
  and inst117 (inst117_out, not_clk, PH_15, result_strob);
  and inst120 (inst120_out, not_clk, PH_16, result_strob);
  and inst123 (inst123_out, not_clk, PH_17, result_strob);
  and inst198 (inst198_out, not_clk, PH_20, result_strob);
  and inst201 (inst201_out, not_clk, PH_21, result_strob);
  and inst204 (inst204_out, not_clk, PH_22, result_strob);
  and inst207 (inst207_out, not_clk, PH_23, result_strob);
  and inst210 (inst210_out, not_clk, PH_24, result_strob);
  and inst213 (inst213_out, not_clk, PH_25, result_strob);
  and inst216 (inst216_out, not_clk, PH_26, result_strob);
  and inst219 (inst219_out, not_clk, PH_27, result_strob);
  and inst294 (inst294_out, not_clk, PH_30, result_strob);
  and inst297 (inst297_out, not_clk, PH_31, result_strob);
  and inst300 (inst300_out, not_clk, PH_32, result_strob);
  and inst303 (inst303_out, not_clk, PH_33, result_strob);
  and inst306 (inst306_out, not_clk, PH_34, result_strob);
  and inst309 (inst309_out, not_clk, PH_35, result_strob);
  and inst312 (inst312_out, not_clk, PH_36, result_strob);
  and inst315 (inst315_out, not_clk, PH_37, result_strob);
  lpm_dff0 inst3 (.data(new_state), .clock(inst5_out), .q(inst3_q));
  lpm_dff0 inst7 (.data(new_state), .clock(inst9_out), .q(inst7_q));
  lpm_dff0 inst10 (.data(new_state), .clock(inst12_out), .q(inst10_q));
  lpm_dff0 inst13 (.data(new_state), .clock(inst15_out), .q(inst13_q));
  lpm_dff0 inst16 (.data(new_state), .clock(inst18_out), .q(inst16_q));
  lpm_dff0 inst19 (.data(new_state), .clock(inst21_out), .q(inst19_q));
  lpm_dff0 inst22 (.data(new_state), .clock(inst24_out), .q(inst22_q));
  lpm_dff0 inst25 (.data(new_state), .clock(inst27_out), .q(inst25_q));
  lpm_dff0 inst100 (.data(new_state), .clock(inst102_out), .q(inst100_q));
  lpm_dff0 inst103 (.data(new_state), .clock(inst105_out), .q(inst103_q));
  lpm_dff0 inst106 (.data(new_state), .clock(inst108_out), .q(inst106_q));
  lpm_dff0 inst109 (.data(new_state), .clock(inst111_out), .q(inst109_q));
  lpm_dff0 inst112 (.data(new_state), .clock(inst114_out), .q(inst112_q));
  lpm_dff0 inst115 (.data(new_state), .clock(inst117_out), .q(inst115_q));
  lpm_dff0 inst118 (.data(new_state), .clock(inst120_out), .q(inst118_q));
  lpm_dff0 inst121 (.data(new_state), .clock(inst123_out), .q(inst121_q));
  lpm_dff0 inst196 (.data(new_state), .clock(inst198_out), .q(inst196_q));
  lpm_dff0 inst199 (.data(new_state), .clock(inst201_out), .q(inst199_q));
  lpm_dff0 inst202 (.data(new_state), .clock(inst204_out), .q(inst202_q));
  lpm_dff0 inst205 (.data(new_state), .clock(inst207_out), .q(inst205_q));
  lpm_dff0 inst208 (.data(new_state), .clock(inst210_out), .q(inst208_q));
  lpm_dff0 inst211 (.data(new_state), .clock(inst213_out), .q(inst211_q));
  lpm_dff0 inst214 (.data(new_state), .clock(inst216_out), .q(inst214_q));
  lpm_dff0 inst217 (.data(new_state), .clock(inst219_out), .q(inst217_q));
  lpm_dff0 inst292 (.data(new_state), .clock(inst294_out), .q(inst292_q));
  lpm_dff0 inst295 (.data(new_state), .clock(inst297_out), .q(inst295_q));
  lpm_dff0 inst298 (.data(new_state), .clock(inst300_out), .q(inst298_q));
  lpm_dff0 inst301 (.data(new_state), .clock(inst303_out), .q(inst301_q));
  lpm_dff0 inst304 (.data(new_state), .clock(inst306_out), .q(inst304_q));
  lpm_dff0 inst307 (.data(new_state), .clock(inst309_out), .q(inst307_q));
  lpm_dff0 inst310 (.data(new_state), .clock(inst312_out), .q(inst310_q));
  lpm_dff0 inst313 (.data(new_state), .clock(inst315_out), .q(inst313_q));
  lpm_bustri0 inst4 (.enabledt(PH_00), .data(inst3_q), .tridata(state));
  lpm_bustri0 inst8 (.enabledt(PH_01), .data(inst7_q), .tridata(state));
  lpm_bustri0 inst11 (.enabledt(PH_02), .data(inst10_q), .tridata(state));
  lpm_bustri0 inst14 (.enabledt(PH_03), .data(inst13_q), .tridata(state));
  lpm_bustri0 inst17 (.enabledt(PH_04), .data(inst16_q), .tridata(state));
  lpm_bustri0 inst20 (.enabledt(PH_05), .data(inst19_q), .tridata(state));
  lpm_bustri0 inst23 (.enabledt(PH_06), .data(inst22_q), .tridata(state));
  lpm_bustri0 inst26 (.enabledt(PH_07), .data(inst25_q), .tridata(state));
  lpm_bustri0 inst101 (.enabledt(PH_10), .data(inst100_q), .tridata(state));
  lpm_bustri0 inst104 (.enabledt(PH_11), .data(inst103_q), .tridata(state));
  lpm_bustri0 inst107 (.enabledt(PH_12), .data(inst106_q), .tridata(state));
  lpm_bustri0 inst110 (.enabledt(PH_13), .data(inst109_q), .tridata(state));
  lpm_bustri0 inst113 (.enabledt(PH_14), .data(inst112_q), .tridata(state));
  lpm_bustri0 inst116 (.enabledt(PH_15), .data(inst115_q), .tridata(state));
  lpm_bustri0 inst119 (.enabledt(PH_16), .data(inst118_q), .tridata(state));
  lpm_bustri0 inst122 (.enabledt(PH_17), .data(inst121_q), .tridata(state));
  lpm_bustri0 inst197 (.enabledt(PH_20), .data(inst196_q), .tridata(state));
  lpm_bustri0 inst200 (.enabledt(PH_21), .data(inst199_q), .tridata(state));
  lpm_bustri0 inst203 (.enabledt(PH_22), .data(inst202_q), .tridata(state));
  lpm_bustri0 inst206 (.enabledt(PH_23), .data(inst205_q), .tridata(state));
  lpm_bustri0 inst209 (.enabledt(PH_24), .data(inst208_q), .tridata(state));
  lpm_bustri0 inst212 (.enabledt(PH_25), .data(inst211_q), .tridata(state));
  lpm_bustri0 inst215 (.enabledt(PH_26), .data(inst214_q), .tridata(state));
  lpm_bustri0 inst218 (.enabledt(PH_27), .data(inst217_q), .tridata(state));
  lpm_bustri0 inst293 (.enabledt(PH_30), .data(inst292_q), .tridata(state));
  lpm_bustri0 inst296 (.enabledt(PH_31), .data(inst295_q), .tridata(state));
  lpm_bustri0 inst299 (.enabledt(PH_32), .data(inst298_q), .tridata(state));
  lpm_bustri0 inst302 (.enabledt(PH_33), .data(inst301_q), .tridata(state));
  lpm_bustri0 inst305 (.enabledt(PH_34), .data(inst304_q), .tridata(state));
  lpm_bustri0 inst308 (.enabledt(PH_35), .data(inst307_q), .tridata(state));
  lpm_bustri0 inst311 (.enabledt(PH_36), .data(inst310_q), .tridata(state));
  lpm_bustri0 inst314 (.enabledt(PH_37), .data(inst313_q), .tridata(state));
  and inst30 (inst30_out, not_clk, PH_08, result_strob);
  and inst33 (inst33_out, not_clk, PH_09, result_strob);
  and inst36 (inst36_out, not_clk, PH_0A, result_strob);
  and inst39 (inst39_out, not_clk, PH_0B, result_strob);
  and inst42 (inst42_out, not_clk, PH_0C, result_strob);
  and inst45 (inst45_out, not_clk, PH_0D, result_strob);
  and inst48 (inst48_out, not_clk, PH_0E, result_strob);
  and inst51 (inst51_out, not_clk, PH_0F, result_strob);
  and inst222 (inst222_out, not_clk, PH_28, result_strob);
  and inst225 (inst225_out, not_clk, PH_29, result_strob);
  and inst228 (inst228_out, not_clk, PH_2A, result_strob);
  and inst231 (inst231_out, not_clk, PH_2B, result_strob);
  and inst234 (inst234_out, not_clk, PH_2C, result_strob);
  and inst237 (inst237_out, not_clk, PH_2D, result_strob);
  and inst240 (inst240_out, not_clk, PH_2E, result_strob);
  and inst243 (inst243_out, not_clk, PH_2F, result_strob);
  and inst126 (inst126_out, not_clk, PH_18, result_strob);
  and inst129 (inst129_out, not_clk, PH_19, result_strob);
  and inst132 (inst132_out, not_clk, PH_1A, result_strob);
  and inst135 (inst135_out, not_clk, PH_1B, result_strob);
  and inst138 (inst138_out, not_clk, PH_1C, result_strob);
  and inst141 (inst141_out, not_clk, PH_1D, result_strob);
  and inst144 (inst144_out, not_clk, PH_1E, result_strob);
  and inst147 (inst147_out, not_clk, PH_1F, result_strob);
  and inst318 (inst318_out, not_clk, PH_38, result_strob);
  and inst321 (inst321_out, not_clk, PH_39, result_strob);
  and inst324 (inst324_out, not_clk, PH_3A, result_strob);
  and inst327 (inst327_out, not_clk, PH_3B, result_strob);
  and inst330 (inst330_out, not_clk, PH_3C, result_strob);
  and inst333 (inst333_out, not_clk, PH_3D, result_strob);
  and inst336 (inst336_out, not_clk, PH_3E, result_strob);
  and inst339 (inst339_out, not_clk, PH_3F, result_strob);
  lpm_dff0 inst28 (.data(new_state), .clock(inst30_out), .q(inst28_q));
  lpm_dff0 inst31 (.data(new_state), .clock(inst33_out), .q(inst31_q));
  lpm_dff0 inst34 (.data(new_state), .clock(inst36_out), .q(inst34_q));
  lpm_dff0 inst37 (.data(new_state), .clock(inst39_out), .q(inst37_q));
  lpm_dff0 inst40 (.data(new_state), .clock(inst42_out), .q(inst40_q));
  lpm_dff0 inst43 (.data(new_state), .clock(inst45_out), .q(inst43_q));
  lpm_dff0 inst46 (.data(new_state), .clock(inst48_out), .q(inst46_q));
  lpm_dff0 inst49 (.data(new_state), .clock(inst51_out), .q(inst49_q));
  lpm_dff0 inst124 (.data(new_state), .clock(inst126_out), .q(inst124_q));
  lpm_dff0 inst127 (.data(new_state), .clock(inst129_out), .q(inst127_q));
  lpm_dff0 inst130 (.data(new_state), .clock(inst132_out), .q(inst130_q));
  lpm_dff0 inst133 (.data(new_state), .clock(inst135_out), .q(inst133_q));
  lpm_dff0 inst136 (.data(new_state), .clock(inst138_out), .q(inst136_q));
  lpm_dff0 inst139 (.data(new_state), .clock(inst141_out), .q(inst139_q));
  lpm_dff0 inst142 (.data(new_state), .clock(inst144_out), .q(inst142_q));
  lpm_dff0 inst145 (.data(new_state), .clock(inst147_out), .q(inst145_q));
  lpm_dff0 inst220 (.data(new_state), .clock(inst222_out), .q(inst220_q));
  lpm_dff0 inst223 (.data(new_state), .clock(inst225_out), .q(inst223_q));
  lpm_dff0 inst226 (.data(new_state), .clock(inst228_out), .q(inst226_q));
  lpm_dff0 inst229 (.data(new_state), .clock(inst231_out), .q(inst229_q));
  lpm_dff0 inst232 (.data(new_state), .clock(inst234_out), .q(inst232_q));
  lpm_dff0 inst235 (.data(new_state), .clock(inst237_out), .q(inst235_q));
  lpm_dff0 inst238 (.data(new_state), .clock(inst240_out), .q(inst238_q));
  lpm_dff0 inst241 (.data(new_state), .clock(inst243_out), .q(inst241_q));
  lpm_dff0 inst316 (.data(new_state), .clock(inst318_out), .q(inst316_q));
  lpm_dff0 inst319 (.data(new_state), .clock(inst321_out), .q(inst319_q));
  lpm_dff0 inst322 (.data(new_state), .clock(inst324_out), .q(inst322_q));
  lpm_dff0 inst325 (.data(new_state), .clock(inst327_out), .q(inst325_q));
  lpm_dff0 inst328 (.data(new_state), .clock(inst330_out), .q(inst328_q));
  lpm_dff0 inst331 (.data(new_state), .clock(inst333_out), .q(inst331_q));
  lpm_dff0 inst334 (.data(new_state), .clock(inst336_out), .q(inst334_q));
  lpm_dff0 inst337 (.data(new_state), .clock(inst339_out), .q(inst337_q));
  lpm_bustri0 inst29 (.enabledt(PH_08), .data(inst28_q), .tridata(state));
  lpm_bustri0 inst32 (.enabledt(PH_09), .data(inst31_q), .tridata(state));
  lpm_bustri0 inst35 (.enabledt(PH_0A), .data(inst34_q), .tridata(state));
  lpm_bustri0 inst38 (.enabledt(PH_0B), .data(inst37_q), .tridata(state));
  lpm_bustri0 inst41 (.enabledt(PH_0C), .data(inst40_q), .tridata(state));
  lpm_bustri0 inst44 (.enabledt(PH_0D), .data(inst43_q), .tridata(state));
  lpm_bustri0 inst47 (.enabledt(PH_0E), .data(inst46_q), .tridata(state));
  lpm_bustri0 inst50 (.enabledt(PH_0F), .data(inst49_q), .tridata(state));
  lpm_bustri0 inst125 (.enabledt(PH_18), .data(inst124_q), .tridata(state));
  lpm_bustri0 inst128 (.enabledt(PH_19), .data(inst127_q), .tridata(state));
  lpm_bustri0 inst131 (.enabledt(PH_1A), .data(inst130_q), .tridata(state));
  lpm_bustri0 inst134 (.enabledt(PH_1B), .data(inst133_q), .tridata(state));
  lpm_bustri0 inst137 (.enabledt(PH_1C), .data(inst136_q), .tridata(state));
  lpm_bustri0 inst140 (.enabledt(PH_1D), .data(inst139_q), .tridata(state));
  lpm_bustri0 inst143 (.enabledt(PH_1E), .data(inst142_q), .tridata(state));
  lpm_bustri0 inst146 (.enabledt(PH_1F), .data(inst145_q), .tridata(state));
  lpm_bustri0 inst221 (.enabledt(PH_28), .data(inst220_q), .tridata(state));
  lpm_bustri0 inst224 (.enabledt(PH_29), .data(inst223_q), .tridata(state));
  lpm_bustri0 inst227 (.enabledt(PH_2A), .data(inst226_q), .tridata(state));
  lpm_bustri0 inst230 (.enabledt(PH_2B), .data(inst229_q), .tridata(state));
  lpm_bustri0 inst233 (.enabledt(PH_2C), .data(inst232_q), .tridata(state));
  lpm_bustri0 inst236 (.enabledt(PH_2D), .data(inst235_q), .tridata(state));
  lpm_bustri0 inst239 (.enabledt(PH_2E), .data(inst238_q), .tridata(state));
  lpm_bustri0 inst242 (.enabledt(PH_2F), .data(inst241_q), .tridata(state));
  lpm_bustri0 inst317 (.enabledt(PH_38), .data(inst316_q), .tridata(state));
  lpm_bustri0 inst320 (.enabledt(PH_39), .data(inst319_q), .tridata(state));
  lpm_bustri0 inst323 (.enabledt(PH_3A), .data(inst322_q), .tridata(state));
  lpm_bustri0 inst326 (.enabledt(PH_3B), .data(inst325_q), .tridata(state));
  lpm_bustri0 inst329 (.enabledt(PH_3C), .data(inst328_q), .tridata(state));
  lpm_bustri0 inst332 (.enabledt(PH_3D), .data(inst331_q), .tridata(state));
  lpm_bustri0 inst335 (.enabledt(PH_3E), .data(inst334_q), .tridata(state));
  lpm_bustri0 inst338 (.enabledt(PH_3F), .data(inst337_q), .tridata(state));
  and inst54 (inst54_out, not_clk, PH_40, result_strob);
  and inst57 (inst57_out, not_clk, PH_41, result_strob);
  and inst60 (inst60_out, not_clk, PH_42, result_strob);
  and inst63 (inst63_out, not_clk, PH_43, result_strob);
  and inst66 (inst66_out, not_clk, PH_44, result_strob);
  and inst69 (inst69_out, not_clk, PH_45, result_strob);
  and inst72 (inst72_out, not_clk, PH_46, result_strob);
  and inst75 (inst75_out, not_clk, PH_47, result_strob);
  and inst150 (inst150_out, not_clk, PH_50, result_strob);
  and inst153 (inst153_out, not_clk, PH_51, result_strob);
  and inst156 (inst156_out, not_clk, PH_52, result_strob);
  and inst159 (inst159_out, not_clk, PH_53, result_strob);
  and inst162 (inst162_out, not_clk, PH_54, result_strob);
  and inst165 (inst165_out, not_clk, PH_55, result_strob);
  and inst168 (inst168_out, not_clk, PH_56, result_strob);
  and inst171 (inst171_out, not_clk, PH_57, result_strob);
  and inst246 (inst246_out, not_clk, PH_60, result_strob);
  and inst249 (inst249_out, not_clk, PH_61, result_strob);
  and inst252 (inst252_out, not_clk, PH_62, result_strob);
  and inst255 (inst255_out, not_clk, PH_63, result_strob);
  and inst258 (inst258_out, not_clk, PH_64, result_strob);
  and inst261 (inst261_out, not_clk, PH_65, result_strob);
  and inst264 (inst264_out, not_clk, PH_66, result_strob);
  and inst267 (inst267_out, not_clk, PH_67, result_strob);
  and inst342 (inst342_out, not_clk, PH_70, result_strob);
  and inst345 (inst345_out, not_clk, PH_71, result_strob);
  and inst348 (inst348_out, not_clk, PH_72, result_strob);
  and inst351 (inst351_out, not_clk, PH_73, result_strob);
  and inst354 (inst354_out, not_clk, PH_74, result_strob);
  and inst357 (inst357_out, not_clk, PH_75, result_strob);
  and inst360 (inst360_out, not_clk, PH_76, result_strob);
  and inst363 (inst363_out, not_clk, PH_77, result_strob);
  lpm_dff0 inst52 (.data(new_state), .clock(inst54_out), .q(inst52_q));
  lpm_dff0 inst55 (.data(new_state), .clock(inst57_out), .q(inst55_q));
  lpm_dff0 inst58 (.data(new_state), .clock(inst60_out), .q(inst58_q));
  lpm_dff0 inst61 (.data(new_state), .clock(inst63_out), .q(inst61_q));
  lpm_dff0 inst64 (.data(new_state), .clock(inst66_out), .q(inst64_q));
  lpm_dff0 inst67 (.data(new_state), .clock(inst69_out), .q(inst67_q));
  lpm_dff0 inst70 (.data(new_state), .clock(inst72_out), .q(inst70_q));
  lpm_dff0 inst73 (.data(new_state), .clock(inst75_out), .q(inst73_q));
  lpm_dff0 inst148 (.data(new_state), .clock(inst150_out), .q(inst148_q));
  lpm_dff0 inst151 (.data(new_state), .clock(inst153_out), .q(inst151_q));
  lpm_dff0 inst154 (.data(new_state), .clock(inst156_out), .q(inst154_q));
  lpm_dff0 inst157 (.data(new_state), .clock(inst159_out), .q(inst157_q));
  lpm_dff0 inst160 (.data(new_state), .clock(inst162_out), .q(inst160_q));
  lpm_dff0 inst163 (.data(new_state), .clock(inst165_out), .q(inst163_q));
  lpm_dff0 inst166 (.data(new_state), .clock(inst168_out), .q(inst166_q));
  lpm_dff0 inst169 (.data(new_state), .clock(inst171_out), .q(inst169_q));
  lpm_dff0 inst244 (.data(new_state), .clock(inst246_out), .q(inst244_q));
  lpm_dff0 inst247 (.data(new_state), .clock(inst249_out), .q(inst247_q));
  lpm_dff0 inst250 (.data(new_state), .clock(inst252_out), .q(inst250_q));
  lpm_dff0 inst253 (.data(new_state), .clock(inst255_out), .q(inst253_q));
  lpm_dff0 inst256 (.data(new_state), .clock(inst258_out), .q(inst256_q));
  lpm_dff0 inst259 (.data(new_state), .clock(inst261_out), .q(inst259_q));
  lpm_dff0 inst262 (.data(new_state), .clock(inst264_out), .q(inst262_q));
  lpm_dff0 inst265 (.data(new_state), .clock(inst267_out), .q(inst265_q));
  lpm_dff0 inst340 (.data(new_state), .clock(inst342_out), .q(inst340_q));
  lpm_dff0 inst343 (.data(new_state), .clock(inst345_out), .q(inst343_q));
  lpm_dff0 inst346 (.data(new_state), .clock(inst348_out), .q(inst346_q));
  lpm_dff0 inst349 (.data(new_state), .clock(inst351_out), .q(inst349_q));
  lpm_dff0 inst352 (.data(new_state), .clock(inst354_out), .q(inst352_q));
  lpm_dff0 inst355 (.data(new_state), .clock(inst357_out), .q(inst355_q));
  lpm_dff0 inst358 (.data(new_state), .clock(inst360_out), .q(inst358_q));
  lpm_dff0 inst361 (.data(new_state), .clock(inst363_out), .q(inst361_q));
  lpm_bustri0 inst53 (.enabledt(PH_40), .data(inst52_q), .tridata(state));
  lpm_bustri0 inst56 (.enabledt(PH_41), .data(inst55_q), .tridata(state));
  lpm_bustri0 inst59 (.enabledt(PH_42), .data(inst58_q), .tridata(state));
  lpm_bustri0 inst62 (.enabledt(PH_43), .data(inst61_q), .tridata(state));
  lpm_bustri0 inst65 (.enabledt(PH_44), .data(inst64_q), .tridata(state));
  lpm_bustri0 inst68 (.enabledt(PH_45), .data(inst67_q), .tridata(state));
  lpm_bustri0 inst71 (.enabledt(PH_46), .data(inst70_q), .tridata(state));
  lpm_bustri0 inst74 (.enabledt(PH_47), .data(inst73_q), .tridata(state));
  lpm_bustri0 inst149 (.enabledt(PH_50), .data(inst148_q), .tridata(state));
  lpm_bustri0 inst152 (.enabledt(PH_51), .data(inst151_q), .tridata(state));
  lpm_bustri0 inst155 (.enabledt(PH_52), .data(inst154_q), .tridata(state));
  lpm_bustri0 inst158 (.enabledt(PH_53), .data(inst157_q), .tridata(state));
  lpm_bustri0 inst161 (.enabledt(PH_54), .data(inst160_q), .tridata(state));
  lpm_bustri0 inst164 (.enabledt(PH_55), .data(inst163_q), .tridata(state));
  lpm_bustri0 inst167 (.enabledt(PH_56), .data(inst166_q), .tridata(state));
  lpm_bustri0 inst170 (.enabledt(PH_57), .data(inst169_q), .tridata(state));
  lpm_bustri0 inst245 (.enabledt(PH_60), .data(inst244_q), .tridata(state));
  lpm_bustri0 inst248 (.enabledt(PH_61), .data(inst247_q), .tridata(state));
  lpm_bustri0 inst251 (.enabledt(PH_62), .data(inst250_q), .tridata(state));
  lpm_bustri0 inst254 (.enabledt(PH_63), .data(inst253_q), .tridata(state));
  lpm_bustri0 inst257 (.enabledt(PH_64), .data(inst256_q), .tridata(state));
  lpm_bustri0 inst260 (.enabledt(PH_65), .data(inst259_q), .tridata(state));
  lpm_bustri0 inst263 (.enabledt(PH_66), .data(inst262_q), .tridata(state));
  lpm_bustri0 inst266 (.enabledt(PH_67), .data(inst265_q), .tridata(state));
  lpm_bustri0 inst341 (.enabledt(PH_70), .data(inst340_q), .tridata(state));
  lpm_bustri0 inst344 (.enabledt(PH_71), .data(inst343_q), .tridata(state));
  lpm_bustri0 inst347 (.enabledt(PH_72), .data(inst346_q), .tridata(state));
  lpm_bustri0 inst350 (.enabledt(PH_73), .data(inst349_q), .tridata(state));
  lpm_bustri0 inst353 (.enabledt(PH_74), .data(inst352_q), .tridata(state));
  lpm_bustri0 inst356 (.enabledt(PH_75), .data(inst355_q), .tridata(state));
  lpm_bustri0 inst359 (.enabledt(PH_76), .data(inst358_q), .tridata(state));
  lpm_bustri0 inst362 (.enabledt(PH_77), .data(inst361_q), .tridata(state));
  and inst78 (inst78_out, not_clk, PH_48, result_strob);
  and inst81 (inst81_out, not_clk, PH_49, result_strob);
  and inst84 (inst84_out, not_clk, PH_4A, result_strob);
  and inst87 (inst87_out, not_clk, PH_4B, result_strob);
  and inst90 (inst90_out, not_clk, PH_4C, result_strob);
  and inst93 (inst93_out, not_clk, PH_4D, result_strob);
  and inst96 (inst96_out, not_clk, PH_4E, result_strob);
  and inst99 (inst99_out, not_clk, PH_4F, result_strob);
  and inst174 (inst174_out, not_clk, PH_58, result_strob);
  and inst177 (inst177_out, not_clk, PH_59, result_strob);
  and inst180 (inst180_out, not_clk, PH_5A, result_strob);
  and inst183 (inst183_out, not_clk, PH_5B, result_strob);
  and inst186 (inst186_out, not_clk, PH_5C, result_strob);
  and inst189 (inst189_out, not_clk, PH_5D, result_strob);
  and inst192 (inst192_out, not_clk, PH_5E, result_strob);
  and inst195 (inst195_out, not_clk, PH_5F, result_strob);
  and inst270 (inst270_out, not_clk, PH_68, result_strob);
  and inst273 (inst273_out, not_clk, PH_69, result_strob);
  and inst276 (inst276_out, not_clk, PH_6A, result_strob);
  and inst279 (inst279_out, not_clk, PH_6B, result_strob);
  and inst282 (inst282_out, not_clk, PH_6C, result_strob);
  and inst285 (inst285_out, not_clk, PH_6D, result_strob);
  and inst288 (inst288_out, not_clk, PH_6E, result_strob);
  and inst291 (inst291_out, not_clk, PH_6F, result_strob);
  and inst366 (inst366_out, not_clk, PH_78, result_strob);
  and inst369 (inst369_out, not_clk, PH_79, result_strob);
  and inst372 (inst372_out, not_clk, PH_7A, result_strob);
  and inst375 (inst375_out, not_clk, PH_7B, result_strob);
  and inst378 (inst378_out, not_clk, PH_7C, result_strob);
  and inst381 (inst381_out, not_clk, PH_7D, result_strob);
  and inst384 (inst384_out, not_clk, PH_7E, result_strob);
  and inst387 (inst387_out, not_clk, PH_7F, result_strob);
  lpm_dff0 inst76 (.data(new_state), .clock(inst78_out), .q(inst76_q));
  lpm_dff0 inst79 (.data(new_state), .clock(inst81_out), .q(inst79_q));
  lpm_dff0 inst82 (.data(new_state), .clock(inst84_out), .q(inst82_q));
  lpm_dff0 inst85 (.data(new_state), .clock(inst87_out), .q(inst85_q));
  lpm_dff0 inst88 (.data(new_state), .clock(inst90_out), .q(inst88_q));
  lpm_dff0 inst91 (.data(new_state), .clock(inst93_out), .q(inst91_q));
  lpm_dff0 inst94 (.data(new_state), .clock(inst96_out), .q(inst94_q));
  lpm_dff0 inst97 (.data(new_state), .clock(inst99_out), .q(inst97_q));
  lpm_dff0 inst172 (.data(new_state), .clock(inst174_out), .q(inst172_q));
  lpm_dff0 inst175 (.data(new_state), .clock(inst177_out), .q(inst175_q));
  lpm_dff0 inst178 (.data(new_state), .clock(inst180_out), .q(inst178_q));
  lpm_dff0 inst181 (.data(new_state), .clock(inst183_out), .q(inst181_q));
  lpm_dff0 inst184 (.data(new_state), .clock(inst186_out), .q(inst184_q));
  lpm_dff0 inst187 (.data(new_state), .clock(inst189_out), .q(inst187_q));
  lpm_dff0 inst190 (.data(new_state), .clock(inst192_out), .q(inst190_q));
  lpm_dff0 inst193 (.data(new_state), .clock(inst195_out), .q(inst193_q));
  lpm_dff0 inst268 (.data(new_state), .clock(inst270_out), .q(inst268_q));
  lpm_dff0 inst271 (.data(new_state), .clock(inst273_out), .q(inst271_q));
  lpm_dff0 inst274 (.data(new_state), .clock(inst276_out), .q(inst274_q));
  lpm_dff0 inst277 (.data(new_state), .clock(inst279_out), .q(inst277_q));
  lpm_dff0 inst280 (.data(new_state), .clock(inst282_out), .q(inst280_q));
  lpm_dff0 inst283 (.data(new_state), .clock(inst285_out), .q(inst283_q));
  lpm_dff0 inst286 (.data(new_state), .clock(inst288_out), .q(inst286_q));
  lpm_dff0 inst289 (.data(new_state), .clock(inst291_out), .q(inst289_q));
  lpm_dff0 inst364 (.data(new_state), .clock(inst366_out), .q(inst364_q));
  lpm_dff0 inst367 (.data(new_state), .clock(inst369_out), .q(inst367_q));
  lpm_dff0 inst370 (.data(new_state), .clock(inst372_out), .q(inst370_q));
  lpm_dff0 inst373 (.data(new_state), .clock(inst375_out), .q(inst373_q));
  lpm_dff0 inst376 (.data(new_state), .clock(inst378_out), .q(inst376_q));
  lpm_dff0 inst379 (.data(new_state), .clock(inst381_out), .q(inst379_q));
  lpm_dff0 inst382 (.data(new_state), .clock(inst384_out), .q(inst382_q));
  lpm_dff0 inst385 (.data(new_state), .clock(inst387_out), .q(inst385_q));
  lpm_bustri0 inst77 (.enabledt(PH_48), .data(inst76_q), .tridata(state));
  lpm_bustri0 inst80 (.enabledt(PH_49), .data(inst79_q), .tridata(state));
  lpm_bustri0 inst83 (.enabledt(PH_4A), .data(inst82_q), .tridata(state));
  lpm_bustri0 inst86 (.enabledt(PH_4B), .data(inst85_q), .tridata(state));
  lpm_bustri0 inst89 (.enabledt(PH_4C), .data(inst88_q), .tridata(state));
  lpm_bustri0 inst92 (.enabledt(PH_4D), .data(inst91_q), .tridata(state));
  lpm_bustri0 inst95 (.enabledt(PH_4E), .data(inst94_q), .tridata(state));
  lpm_bustri0 inst98 (.enabledt(PH_4F), .data(inst97_q), .tridata(state));
  lpm_bustri0 inst269 (.enabledt(PH_68), .data(inst268_q), .tridata(state));
  lpm_bustri0 inst272 (.enabledt(PH_69), .data(inst271_q), .tridata(state));
  lpm_bustri0 inst275 (.enabledt(PH_6A), .data(inst274_q), .tridata(state));
  lpm_bustri0 inst278 (.enabledt(PH_6B), .data(inst277_q), .tridata(state));
  lpm_bustri0 inst281 (.enabledt(PH_6C), .data(inst280_q), .tridata(state));
  lpm_bustri0 inst284 (.enabledt(PH_6D), .data(inst283_q), .tridata(state));
  lpm_bustri0 inst287 (.enabledt(PH_6E), .data(inst286_q), .tridata(state));
  lpm_bustri0 inst290 (.enabledt(PH_6F), .data(inst289_q), .tridata(state));
  lpm_bustri0 inst173 (.enabledt(PH_58), .data(inst172_q), .tridata(state));
  lpm_bustri0 inst176 (.enabledt(PH_59), .data(inst175_q), .tridata(state));
  lpm_bustri0 inst179 (.enabledt(PH_5A), .data(inst178_q), .tridata(state));
  lpm_bustri0 inst182 (.enabledt(PH_5B), .data(inst181_q), .tridata(state));
  lpm_bustri0 inst185 (.enabledt(PH_5C), .data(inst184_q), .tridata(state));
  lpm_bustri0 inst188 (.enabledt(PH_5D), .data(inst187_q), .tridata(state));
  lpm_bustri0 inst191 (.enabledt(PH_5E), .data(inst190_q), .tridata(state));
  lpm_bustri0 inst194 (.enabledt(PH_5F), .data(inst193_q), .tridata(state));
  lpm_bustri0 inst365 (.enabledt(PH_78), .data(inst364_q), .tridata(state));
  lpm_bustri0 inst368 (.enabledt(PH_79), .data(inst367_q), .tridata(state));
  lpm_bustri0 inst371 (.enabledt(PH_7A), .data(inst370_q), .tridata(state));
  lpm_bustri0 inst374 (.enabledt(PH_7B), .data(inst373_q), .tridata(state));
  lpm_bustri0 inst377 (.enabledt(PH_7C), .data(inst376_q), .tridata(state));
  lpm_bustri0 inst380 (.enabledt(PH_7D), .data(inst379_q), .tridata(state));
  lpm_bustri0 inst383 (.enabledt(PH_7E), .data(inst382_q), .tridata(state));
  lpm_bustri0 inst386 (.enabledt(PH_7F), .data(inst385_q), .tridata(state));
  and inst390 (inst390_out, not_clk, PH_80, result_strob);
  and inst393 (inst393_out, not_clk, PH_81, result_strob);
  and inst396 (inst396_out, not_clk, PH_82, result_strob);
  and inst399 (inst399_out, not_clk, PH_83, result_strob);
  and inst402 (inst402_out, not_clk, PH_84, result_strob);
  and inst405 (inst405_out, not_clk, PH_85, result_strob);
  and inst408 (inst408_out, not_clk, PH_86, result_strob);
  and inst411 (inst411_out, not_clk, PH_87, result_strob);
  and inst486 (inst486_out, not_clk, PH_90, result_strob);
  and inst489 (inst489_out, not_clk, PH_91, result_strob);
  and inst492 (inst492_out, not_clk, PH_92, result_strob);
  and inst495 (inst495_out, not_clk, PH_93, result_strob);
  and inst498 (inst498_out, not_clk, PH_94, result_strob);
  and inst501 (inst501_out, not_clk, PH_95, result_strob);
  and inst504 (inst504_out, not_clk, PH_96, result_strob);
  and inst507 (inst507_out, not_clk, PH_97, result_strob);
  and inst582 (inst582_out, not_clk, PH_A0, result_strob);
  and inst585 (inst585_out, not_clk, PH_A1, result_strob);
  and inst588 (inst588_out, not_clk, PH_A2, result_strob);
  and inst591 (inst591_out, not_clk, PH_A3, result_strob);
  and inst594 (inst594_out, not_clk, PH_A4, result_strob);
  and inst597 (inst597_out, not_clk, PH_A5, result_strob);
  and inst600 (inst600_out, not_clk, PH_A6, result_strob);
  and inst603 (inst603_out, not_clk, PH_A7, result_strob);
  and inst678 (inst678_out, not_clk, PH_B0, result_strob);
  and inst681 (inst681_out, not_clk, PH_B1, result_strob);
  and inst684 (inst684_out, not_clk, PH_B2, result_strob);
  and inst687 (inst687_out, not_clk, PH_B3, result_strob);
  and inst690 (inst690_out, not_clk, PH_B4, result_strob);
  and inst693 (inst693_out, not_clk, PH_B5, result_strob);
  and inst696 (inst696_out, not_clk, PH_B6, result_strob);
  and inst699 (inst699_out, not_clk, PH_B7, result_strob);
  lpm_dff0 inst388 (.data(new_state), .clock(inst390_out), .q(inst388_q));
  lpm_dff0 inst391 (.data(new_state), .clock(inst393_out), .q(inst391_q));
  lpm_dff0 inst394 (.data(new_state), .clock(inst396_out), .q(inst394_q));
  lpm_dff0 inst397 (.data(new_state), .clock(inst399_out), .q(inst397_q));
  lpm_dff0 inst400 (.data(new_state), .clock(inst402_out), .q(inst400_q));
  lpm_dff0 inst403 (.data(new_state), .clock(inst405_out), .q(inst403_q));
  lpm_dff0 inst406 (.data(new_state), .clock(inst408_out), .q(inst406_q));
  lpm_dff0 inst409 (.data(new_state), .clock(inst411_out), .q(inst409_q));
  lpm_dff0 inst484 (.data(new_state), .clock(inst486_out), .q(inst484_q));
  lpm_dff0 inst487 (.data(new_state), .clock(inst489_out), .q(inst487_q));
  lpm_dff0 inst490 (.data(new_state), .clock(inst492_out), .q(inst490_q));
  lpm_dff0 inst493 (.data(new_state), .clock(inst495_out), .q(inst493_q));
  lpm_dff0 inst496 (.data(new_state), .clock(inst498_out), .q(inst496_q));
  lpm_dff0 inst499 (.data(new_state), .clock(inst501_out), .q(inst499_q));
  lpm_dff0 inst502 (.data(new_state), .clock(inst504_out), .q(inst502_q));
  lpm_dff0 inst505 (.data(new_state), .clock(inst507_out), .q(inst505_q));
  lpm_dff0 inst580 (.data(new_state), .clock(inst582_out), .q(inst580_q));
  lpm_dff0 inst583 (.data(new_state), .clock(inst585_out), .q(inst583_q));
  lpm_dff0 inst586 (.data(new_state), .clock(inst588_out), .q(inst586_q));
  lpm_dff0 inst589 (.data(new_state), .clock(inst591_out), .q(inst589_q));
  lpm_dff0 inst592 (.data(new_state), .clock(inst594_out), .q(inst592_q));
  lpm_dff0 inst595 (.data(new_state), .clock(inst597_out), .q(inst595_q));
  lpm_dff0 inst598 (.data(new_state), .clock(inst600_out), .q(inst598_q));
  lpm_dff0 inst601 (.data(new_state), .clock(inst603_out), .q(inst601_q));
  lpm_dff0 inst676 (.data(new_state), .clock(inst678_out), .q(inst676_q));
  lpm_dff0 inst679 (.data(new_state), .clock(inst681_out), .q(inst679_q));
  lpm_dff0 inst682 (.data(new_state), .clock(inst684_out), .q(inst682_q));
  lpm_dff0 inst685 (.data(new_state), .clock(inst687_out), .q(inst685_q));
  lpm_dff0 inst688 (.data(new_state), .clock(inst690_out), .q(inst688_q));
  lpm_dff0 inst691 (.data(new_state), .clock(inst693_out), .q(inst691_q));
  lpm_dff0 inst694 (.data(new_state), .clock(inst696_out), .q(inst694_q));
  lpm_dff0 inst697 (.data(new_state), .clock(inst699_out), .q(inst697_q));
  lpm_bustri0 inst389 (.enabledt(PH_80), .data(inst388_q), .tridata(state));
  lpm_bustri0 inst392 (.enabledt(PH_81), .data(inst391_q), .tridata(state));
  lpm_bustri0 inst395 (.enabledt(PH_82), .data(inst394_q), .tridata(state));
  lpm_bustri0 inst398 (.enabledt(PH_83), .data(inst397_q), .tridata(state));
  lpm_bustri0 inst401 (.enabledt(PH_84), .data(inst400_q), .tridata(state));
  lpm_bustri0 inst404 (.enabledt(PH_85), .data(inst403_q), .tridata(state));
  lpm_bustri0 inst407 (.enabledt(PH_86), .data(inst406_q), .tridata(state));
  lpm_bustri0 inst410 (.enabledt(PH_87), .data(inst409_q), .tridata(state));
  lpm_bustri0 inst581 (.enabledt(PH_A0), .data(inst580_q), .tridata(state));
  lpm_bustri0 inst584 (.enabledt(PH_A1), .data(inst583_q), .tridata(state));
  lpm_bustri0 inst587 (.enabledt(PH_A2), .data(inst586_q), .tridata(state));
  lpm_bustri0 inst590 (.enabledt(PH_A3), .data(inst589_q), .tridata(state));
  lpm_bustri0 inst593 (.enabledt(PH_A4), .data(inst592_q), .tridata(state));
  lpm_bustri0 inst596 (.enabledt(PH_A5), .data(inst595_q), .tridata(state));
  lpm_bustri0 inst599 (.enabledt(PH_A6), .data(inst598_q), .tridata(state));
  lpm_bustri0 inst602 (.enabledt(PH_A7), .data(inst601_q), .tridata(state));
  lpm_bustri0 inst485 (.enabledt(PH_90), .data(inst484_q), .tridata(state));
  lpm_bustri0 inst488 (.enabledt(PH_91), .data(inst487_q), .tridata(state));
  lpm_bustri0 inst491 (.enabledt(PH_92), .data(inst490_q), .tridata(state));
  lpm_bustri0 inst494 (.enabledt(PH_93), .data(inst493_q), .tridata(state));
  lpm_bustri0 inst497 (.enabledt(PH_94), .data(inst496_q), .tridata(state));
  lpm_bustri0 inst500 (.enabledt(PH_95), .data(inst499_q), .tridata(state));
  lpm_bustri0 inst503 (.enabledt(PH_96), .data(inst502_q), .tridata(state));
  lpm_bustri0 inst506 (.enabledt(PH_97), .data(inst505_q), .tridata(state));
  lpm_bustri0 inst677 (.enabledt(PH_B0), .data(inst676_q), .tridata(state));
  lpm_bustri0 inst680 (.enabledt(PH_B1), .data(inst679_q), .tridata(state));
  lpm_bustri0 inst683 (.enabledt(PH_B2), .data(inst682_q), .tridata(state));
  lpm_bustri0 inst686 (.enabledt(PH_B3), .data(inst685_q), .tridata(state));
  lpm_bustri0 inst689 (.enabledt(PH_B4), .data(inst688_q), .tridata(state));
  lpm_bustri0 inst692 (.enabledt(PH_B5), .data(inst691_q), .tridata(state));
  lpm_bustri0 inst695 (.enabledt(PH_B6), .data(inst694_q), .tridata(state));
  lpm_bustri0 inst698 (.enabledt(PH_B7), .data(inst697_q), .tridata(state));
  and inst414 (inst414_out, not_clk, PH_88, result_strob);
  and inst417 (inst417_out, not_clk, PH_89, result_strob);
  and inst420 (inst420_out, not_clk, PH_8A, result_strob);
  and inst423 (inst423_out, not_clk, PH_8B, result_strob);
  and inst426 (inst426_out, not_clk, PH_8C, result_strob);
  and inst429 (inst429_out, not_clk, PH_8D, result_strob);
  and inst432 (inst432_out, not_clk, PH_8E, result_strob);
  and inst435 (inst435_out, not_clk, PH_8F, result_strob);
  and inst510 (inst510_out, not_clk, PH_98, result_strob);
  and inst513 (inst513_out, not_clk, PH_99, result_strob);
  and inst516 (inst516_out, not_clk, PH_9A, result_strob);
  and inst519 (inst519_out, not_clk, PH_9B, result_strob);
  and inst522 (inst522_out, not_clk, PH_9C, result_strob);
  and inst525 (inst525_out, not_clk, PH_9D, result_strob);
  and inst528 (inst528_out, not_clk, PH_9E, result_strob);
  and inst531 (inst531_out, not_clk, PH_9F, result_strob);
  and inst606 (inst606_out, not_clk, PH_A8, result_strob);
  and inst609 (inst609_out, not_clk, PH_A9, result_strob);
  and inst612 (inst612_out, not_clk, PH_AA, result_strob);
  and inst615 (inst615_out, not_clk, PH_AB, result_strob);
  and inst618 (inst618_out, not_clk, PH_AC, result_strob);
  and inst621 (inst621_out, not_clk, PH_AD, result_strob);
  and inst624 (inst624_out, not_clk, PH_AE, result_strob);
  and inst627 (inst627_out, not_clk, PH_AF, result_strob);
  and inst702 (inst702_out, not_clk, PH_B8, result_strob);
  and inst705 (inst705_out, not_clk, PH_B9, result_strob);
  and inst708 (inst708_out, not_clk, PH_BA, result_strob);
  and inst711 (inst711_out, not_clk, PH_BB, result_strob);
  and inst714 (inst714_out, not_clk, PH_BC, result_strob);
  and inst717 (inst717_out, not_clk, PH_BD, result_strob);
  and inst720 (inst720_out, not_clk, PH_BE, result_strob);
  and inst723 (inst723_out, not_clk, PH_BF, result_strob);
  lpm_dff0 inst412 (.data(new_state), .clock(inst414_out), .q(inst412_q));
  lpm_dff0 inst415 (.data(new_state), .clock(inst417_out), .q(inst415_q));
  lpm_dff0 inst418 (.data(new_state), .clock(inst420_out), .q(inst418_q));
  lpm_dff0 inst421 (.data(new_state), .clock(inst423_out), .q(inst421_q));
  lpm_dff0 inst424 (.data(new_state), .clock(inst426_out), .q(inst424_q));
  lpm_dff0 inst427 (.data(new_state), .clock(inst429_out), .q(inst427_q));
  lpm_dff0 inst430 (.data(new_state), .clock(inst432_out), .q(inst430_q));
  lpm_dff0 inst433 (.data(new_state), .clock(inst435_out), .q(inst433_q));
  lpm_dff0 inst508 (.data(new_state), .clock(inst510_out), .q(inst508_q));
  lpm_dff0 inst511 (.data(new_state), .clock(inst513_out), .q(inst511_q));
  lpm_dff0 inst514 (.data(new_state), .clock(inst516_out), .q(inst514_q));
  lpm_dff0 inst517 (.data(new_state), .clock(inst519_out), .q(inst517_q));
  lpm_dff0 inst520 (.data(new_state), .clock(inst522_out), .q(inst520_q));
  lpm_dff0 inst523 (.data(new_state), .clock(inst525_out), .q(inst523_q));
  lpm_dff0 inst526 (.data(new_state), .clock(inst528_out), .q(inst526_q));
  lpm_dff0 inst529 (.data(new_state), .clock(inst531_out), .q(inst529_q));
  lpm_dff0 inst604 (.data(new_state), .clock(inst606_out), .q(inst604_q));
